# Altium schematic sheet ADAS_ECU_revA.SchDoc (part 1 of 2)
size E; SheetNumber: 1; SheetTotal: 19
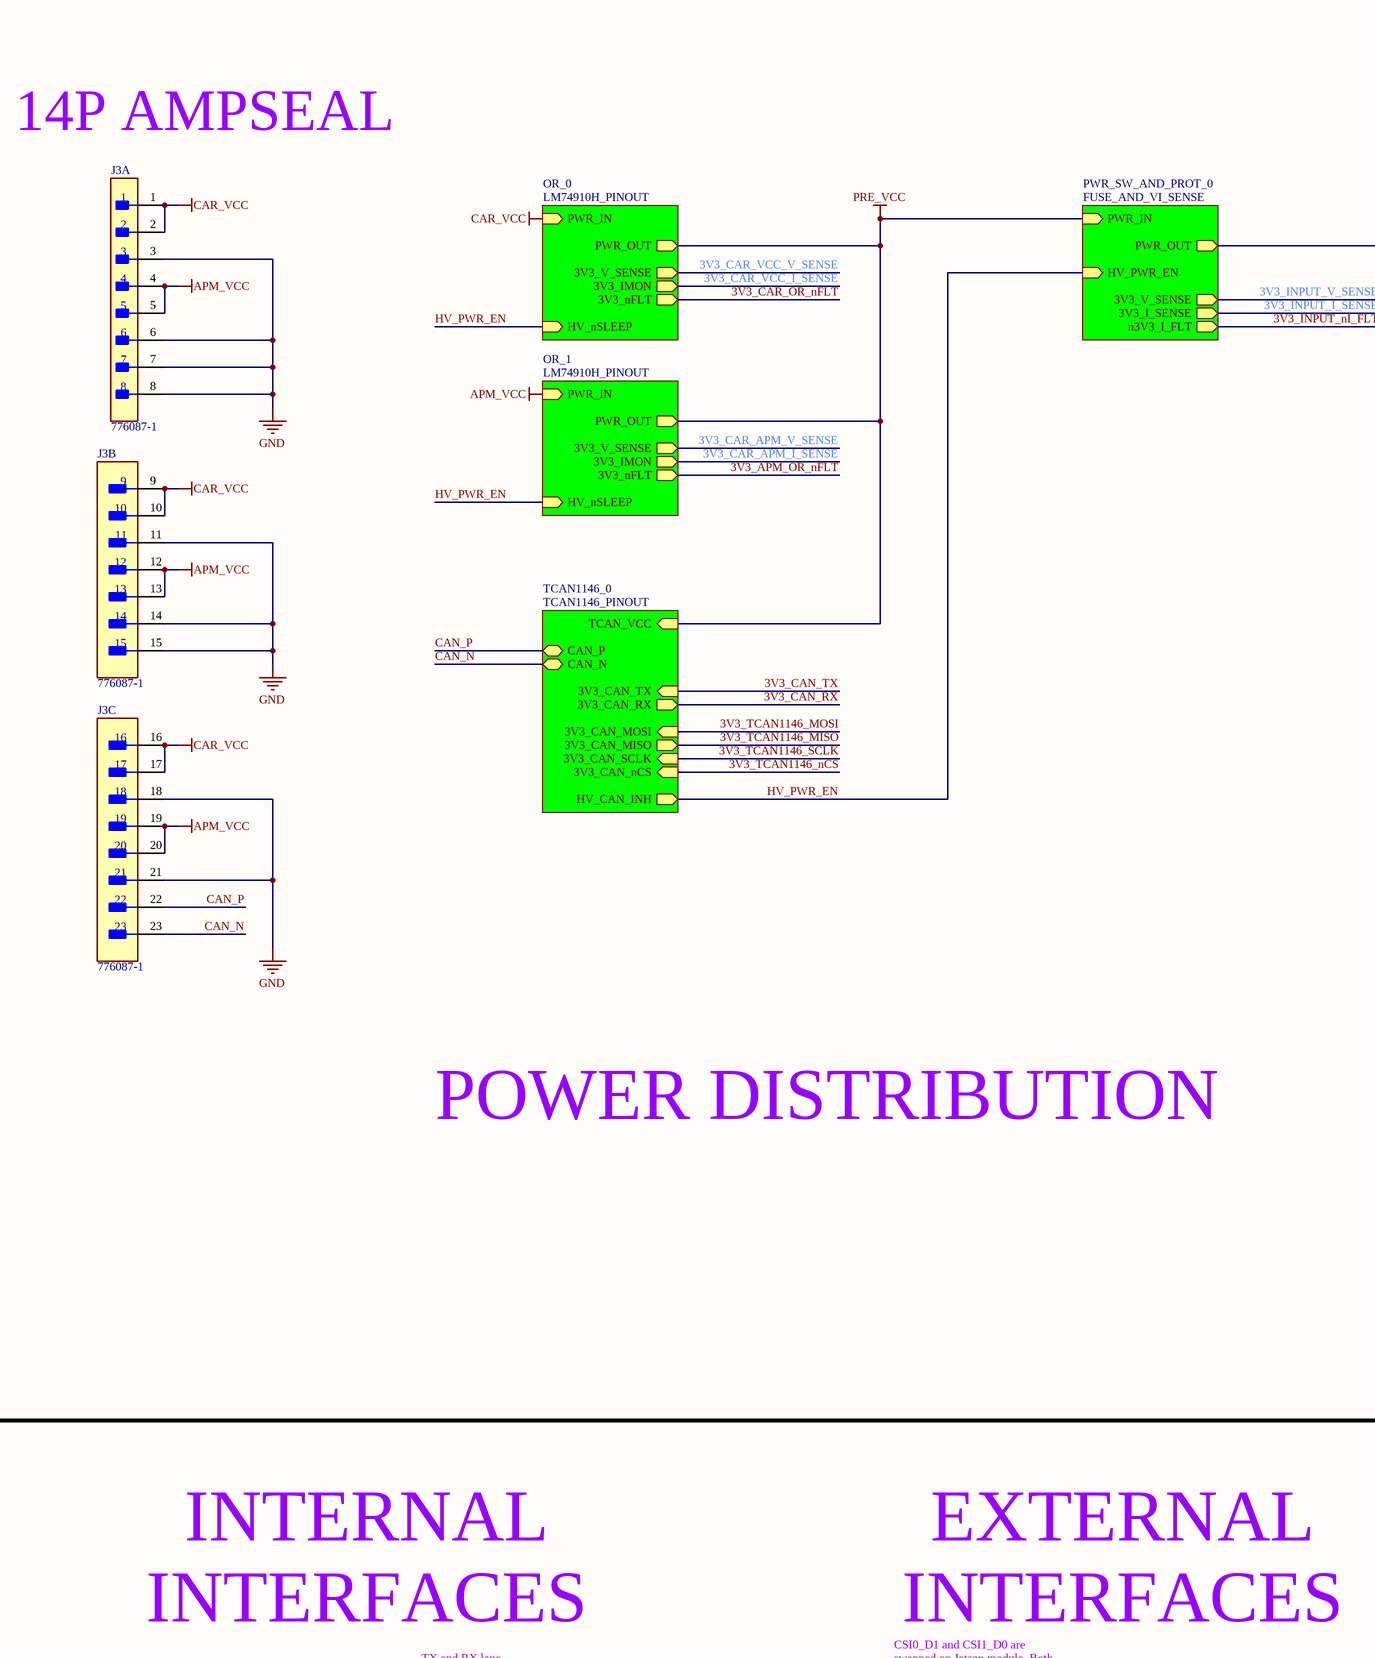
[diagram p0: ADAS_ECU_revA.SchDoc, top column 1 of 4]
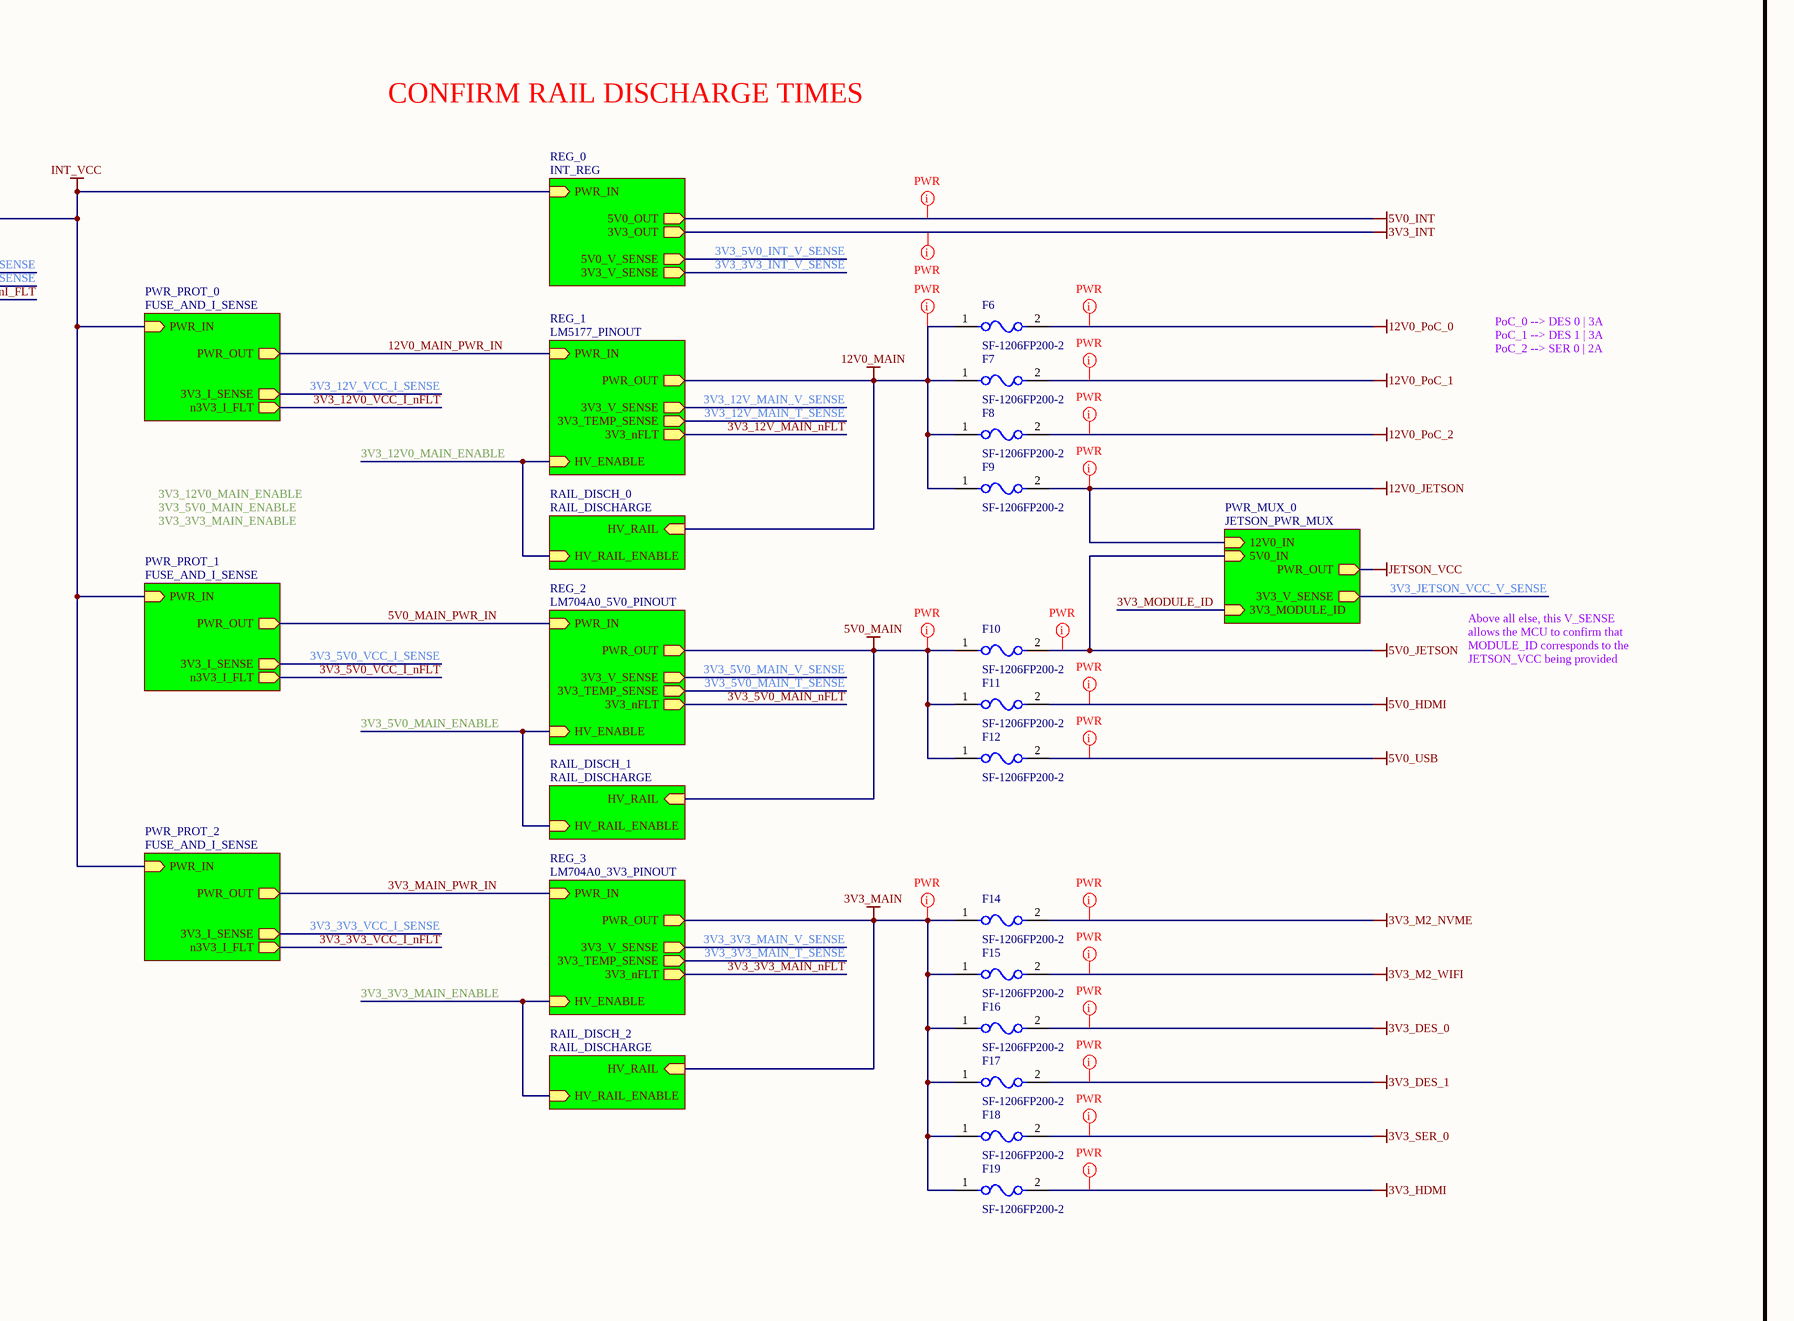
[diagram p1: ADAS_ECU_revA.SchDoc, top column 2 of 4]
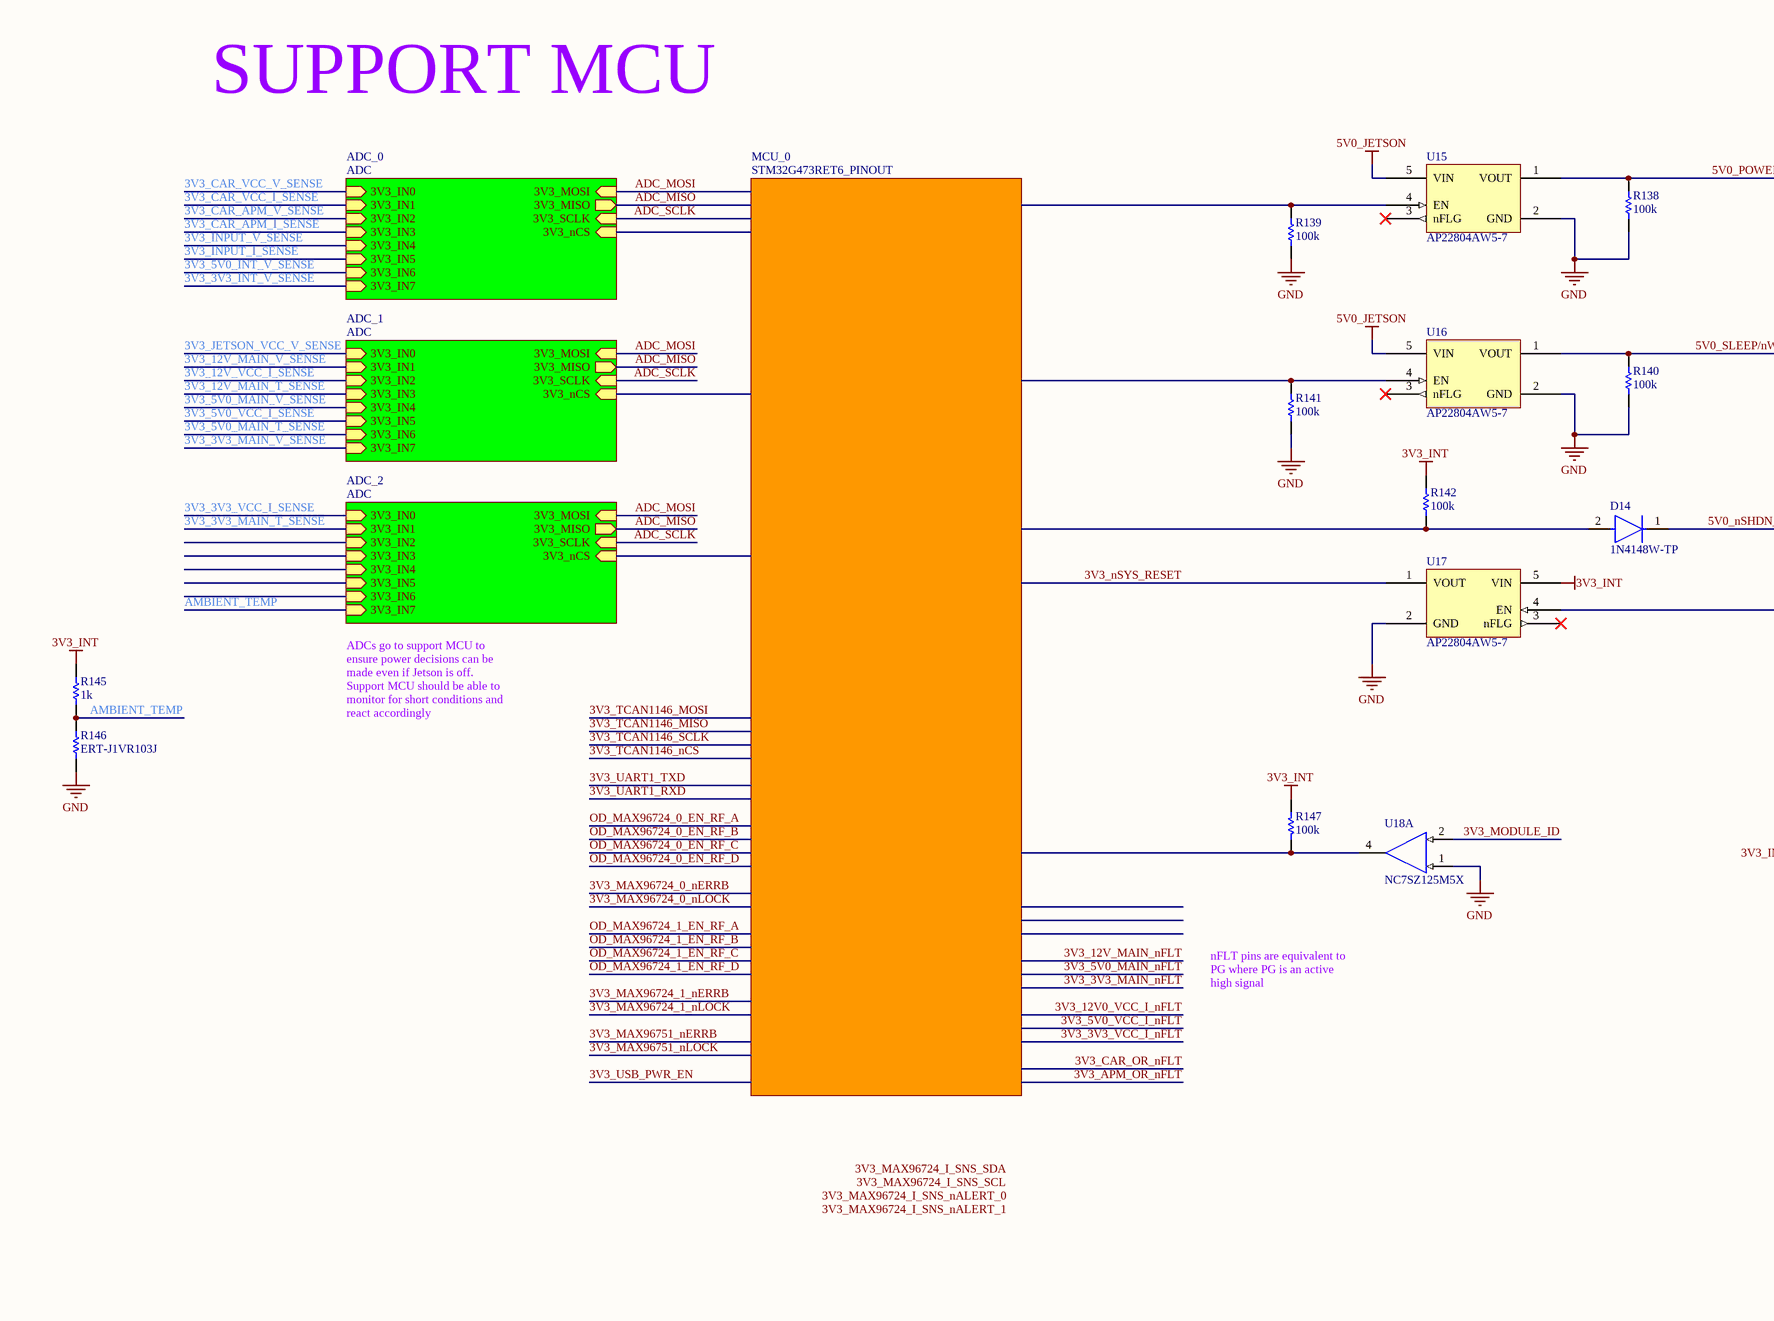
[diagram p2: ADAS_ECU_revA.SchDoc, top column 3 of 4]
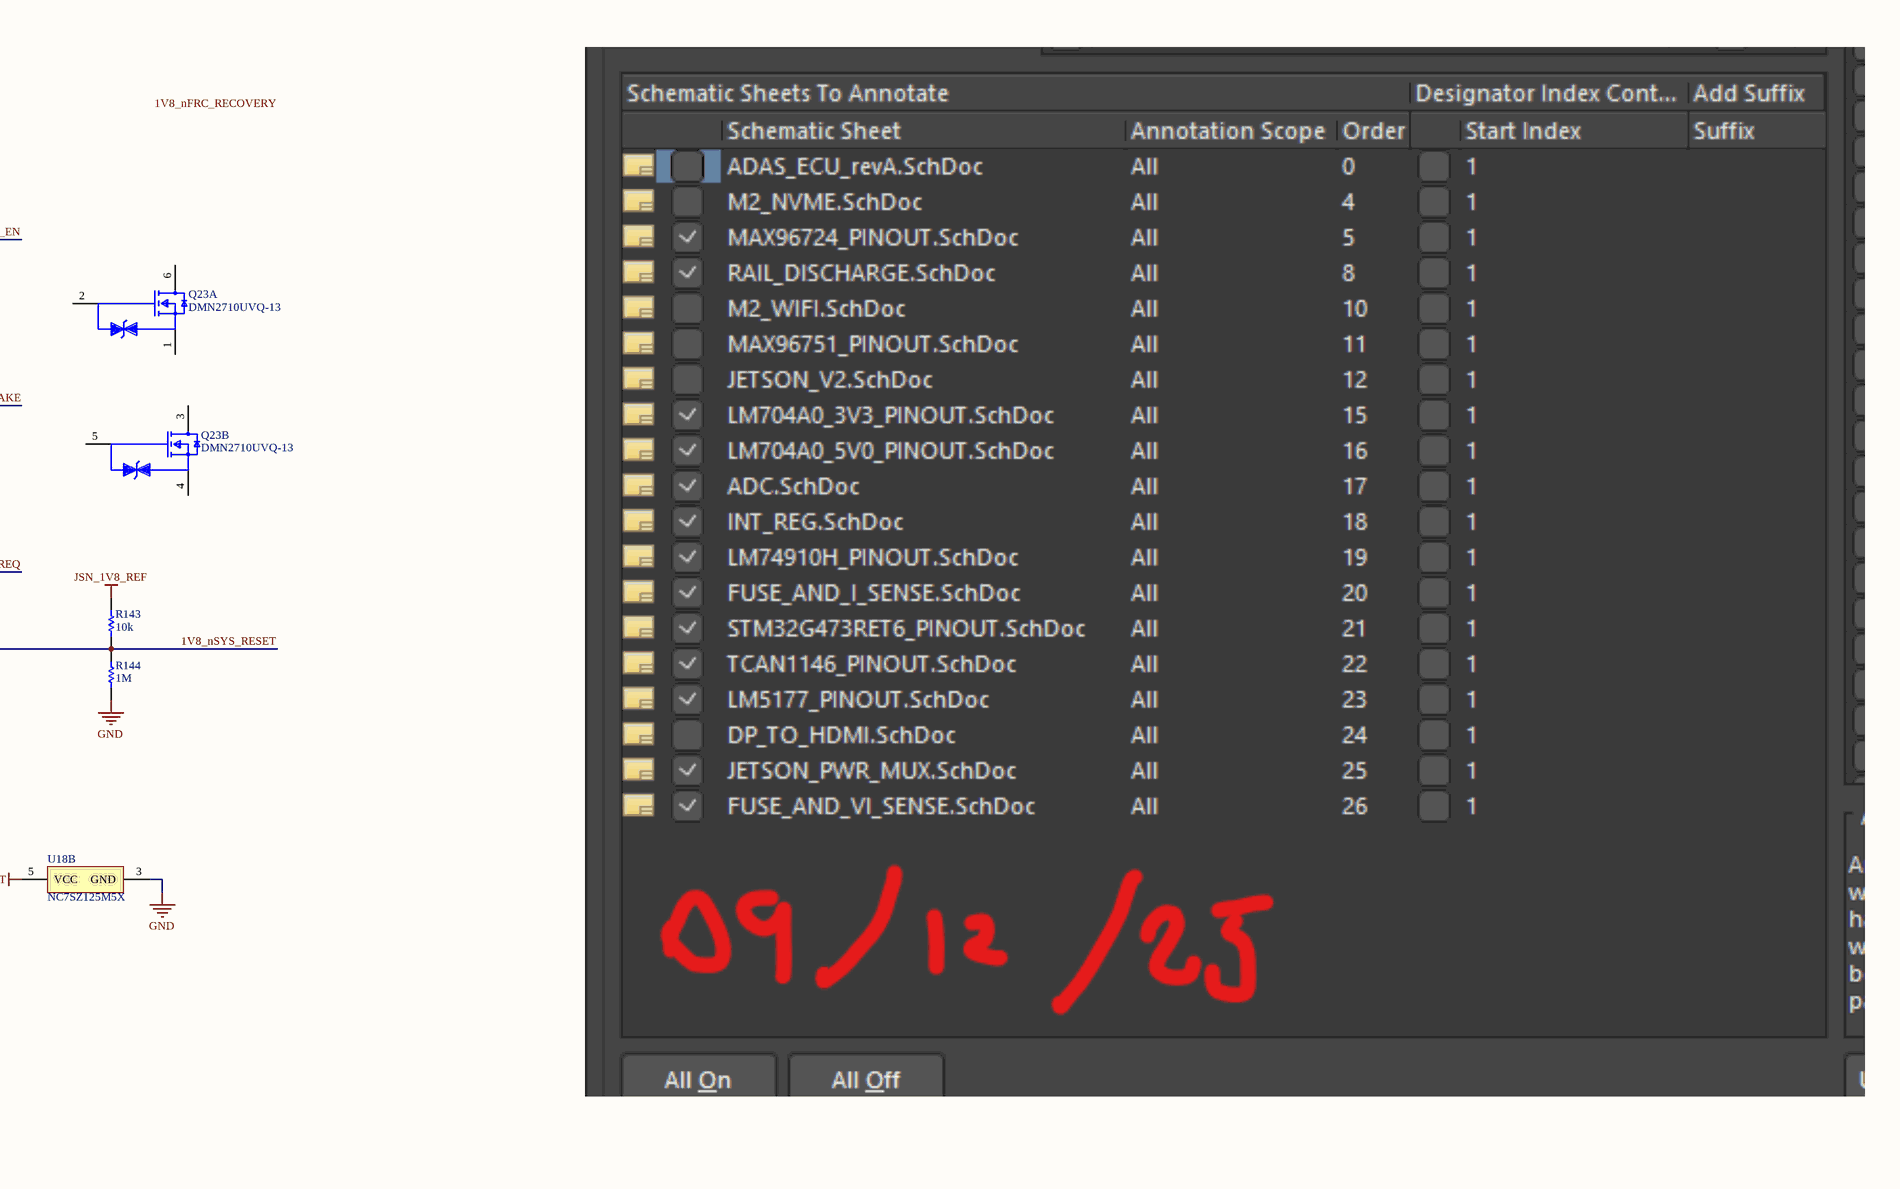
[diagram p3: ADAS_ECU_revA.SchDoc, top column 4 of 4]
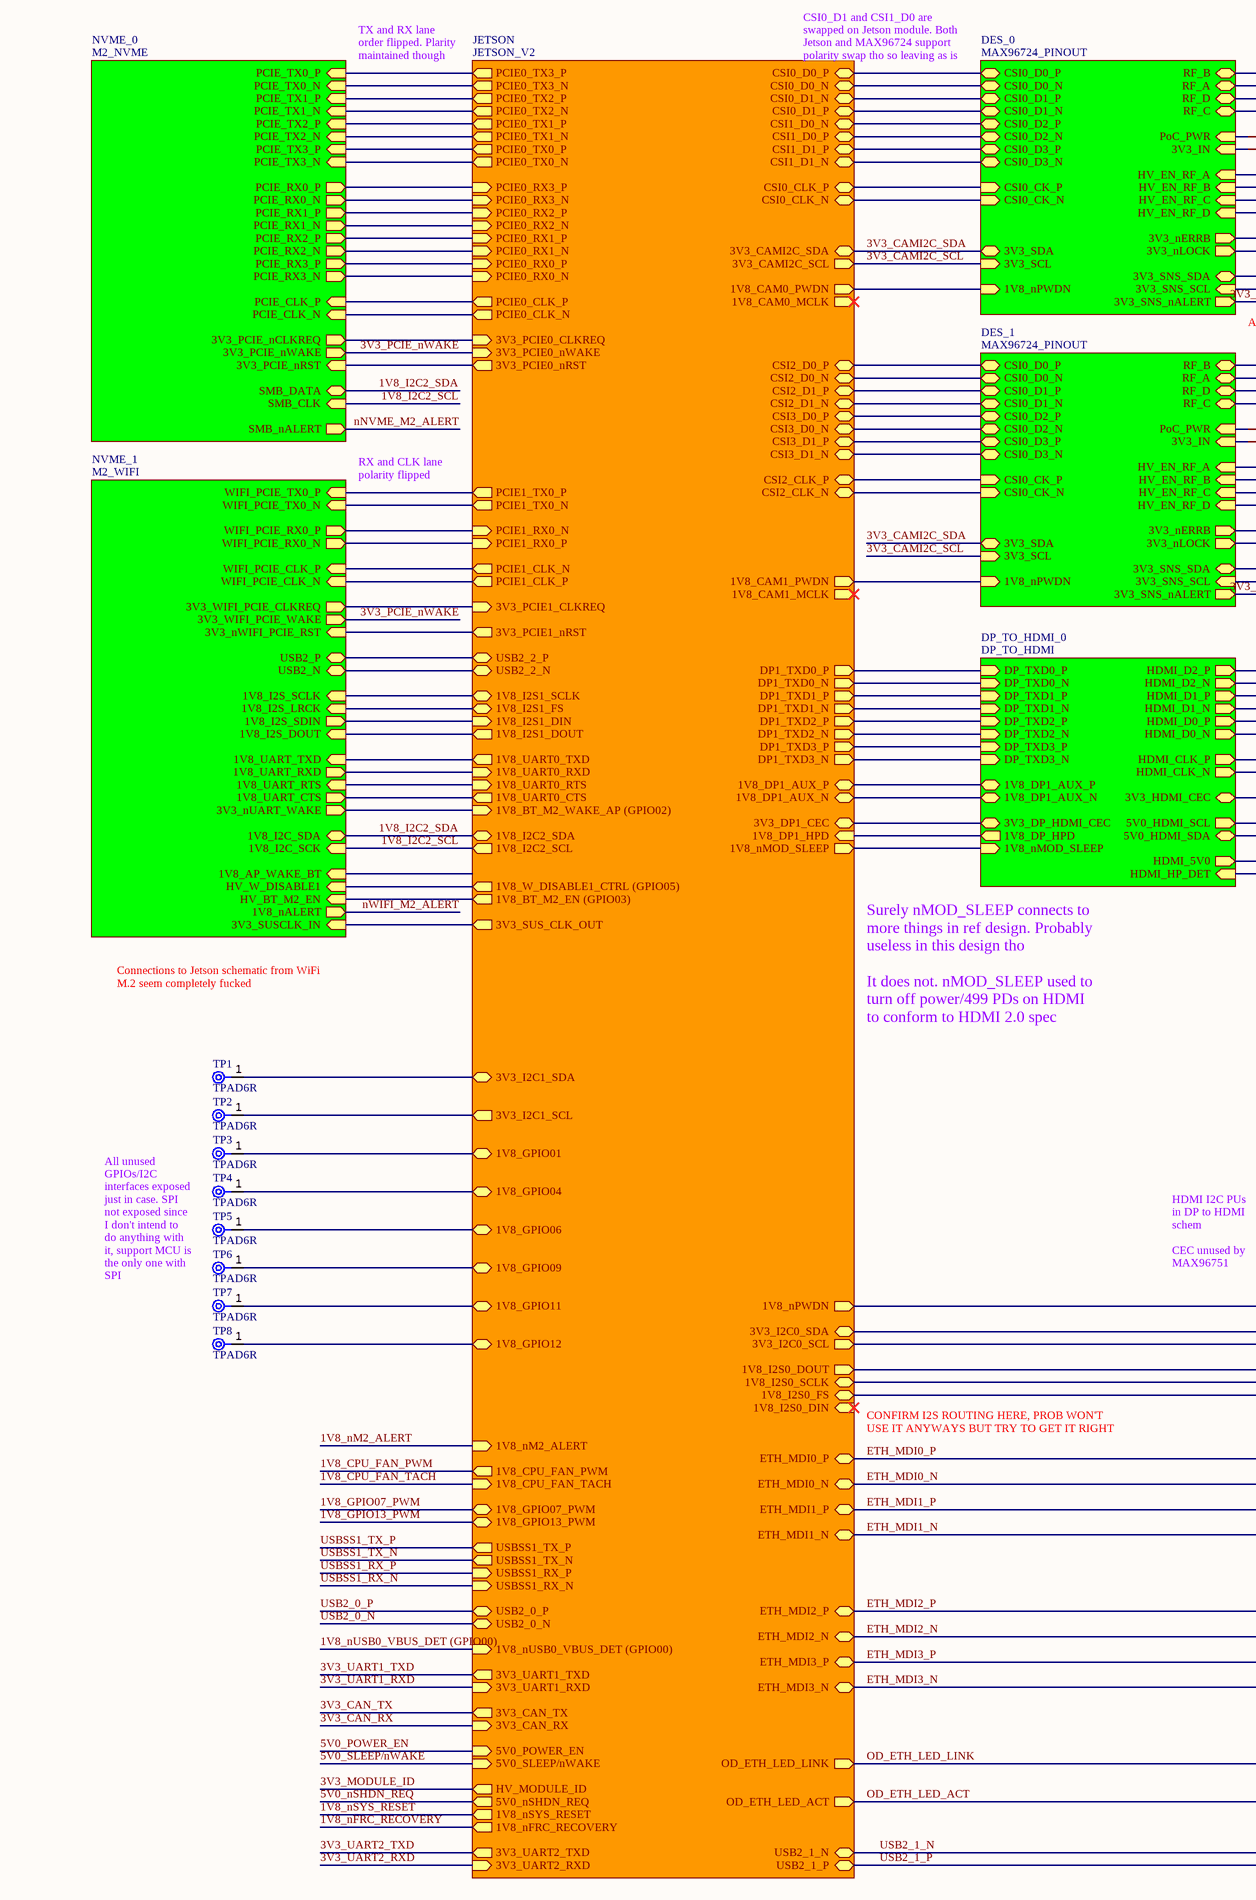
[diagram p4: ADAS_ECU_revA.SchDoc, centre column 1 of 4]
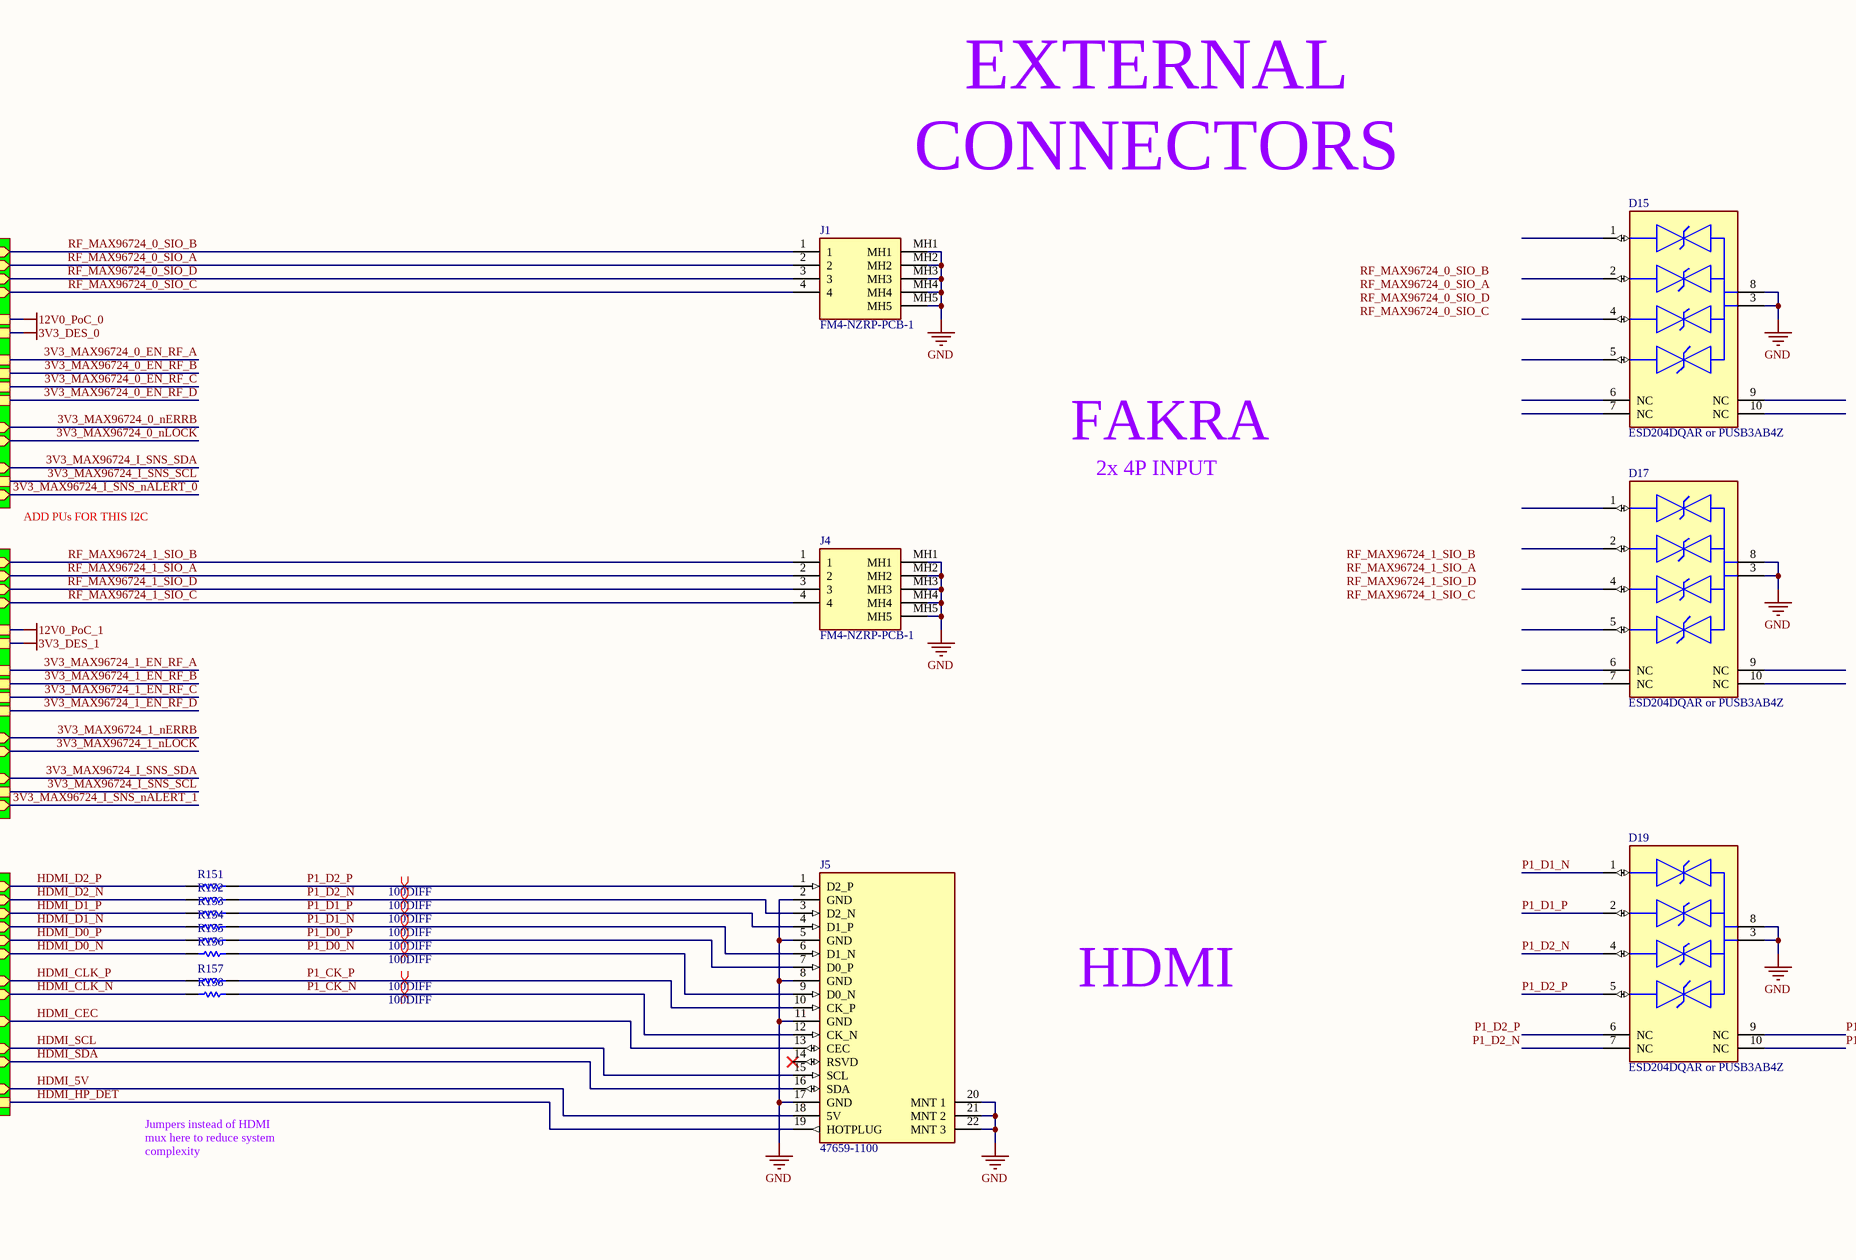
[diagram p5: ADAS_ECU_revA.SchDoc, centre column 2 of 4]
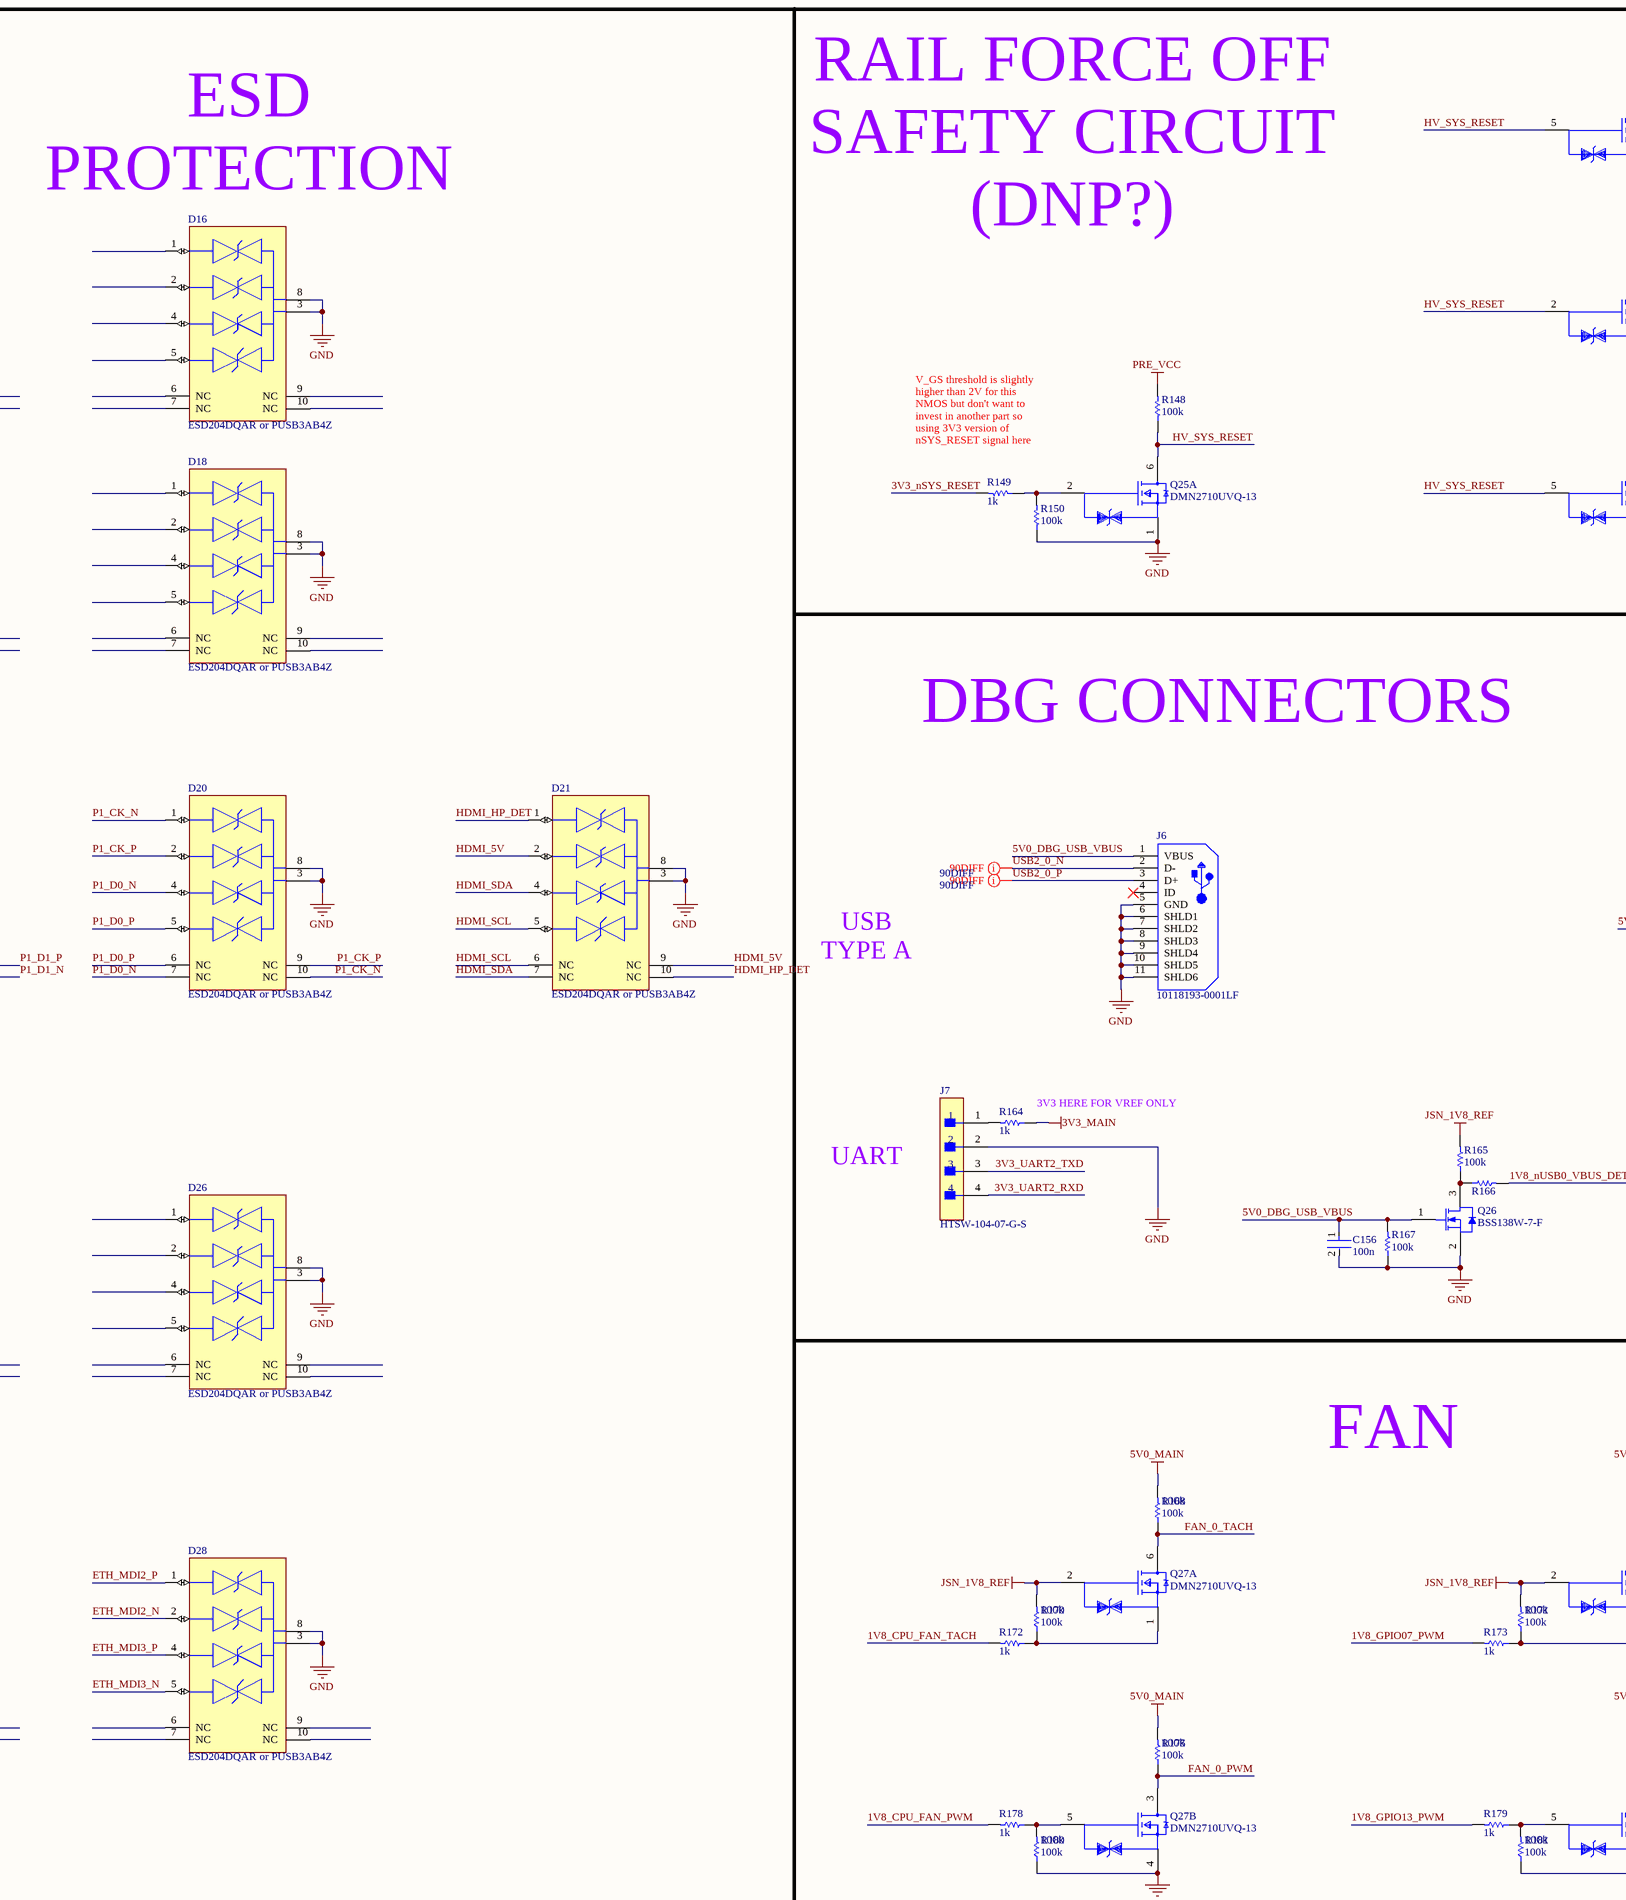
[diagram p6: ADAS_ECU_revA.SchDoc, centre column 3 of 4]
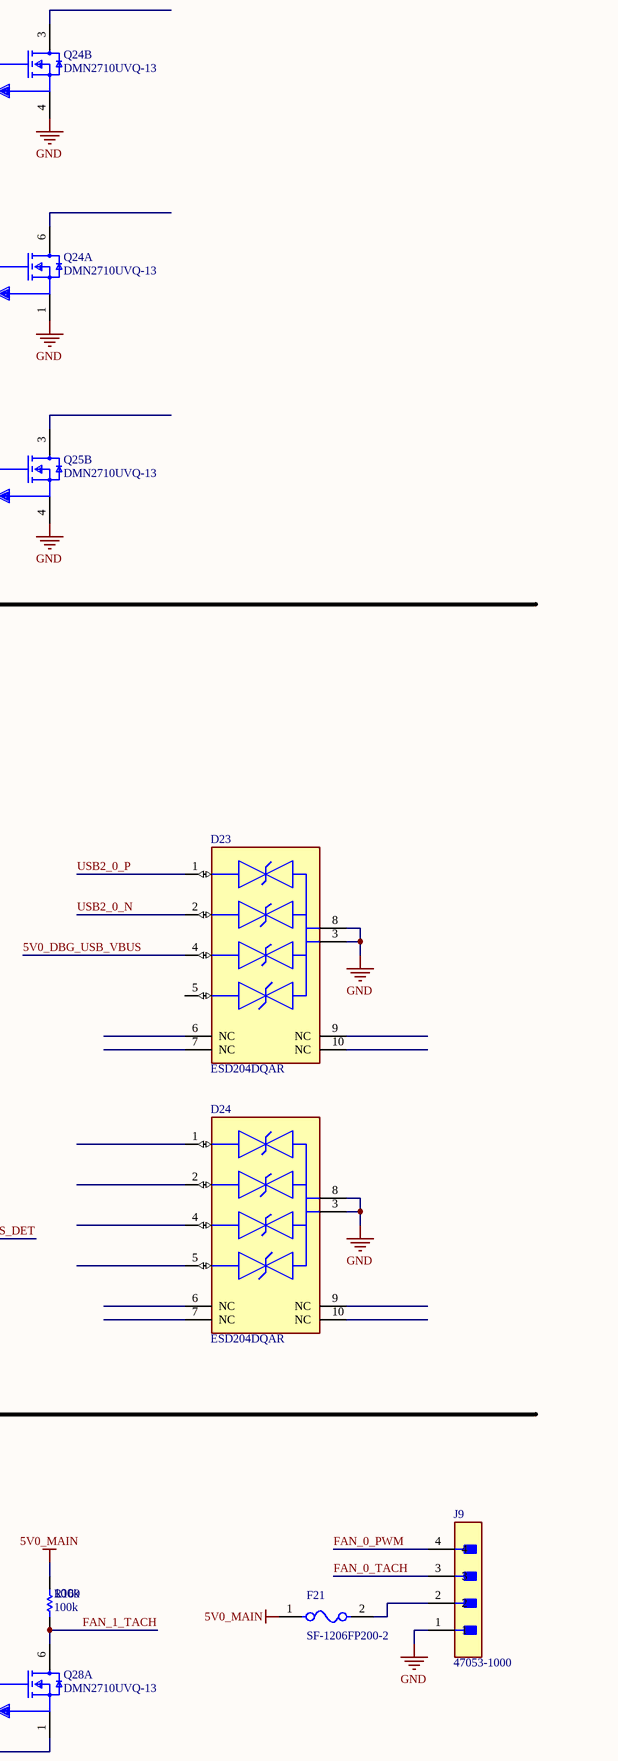
[diagram p7: ADAS_ECU_revA.SchDoc, centre column 4 of 4]
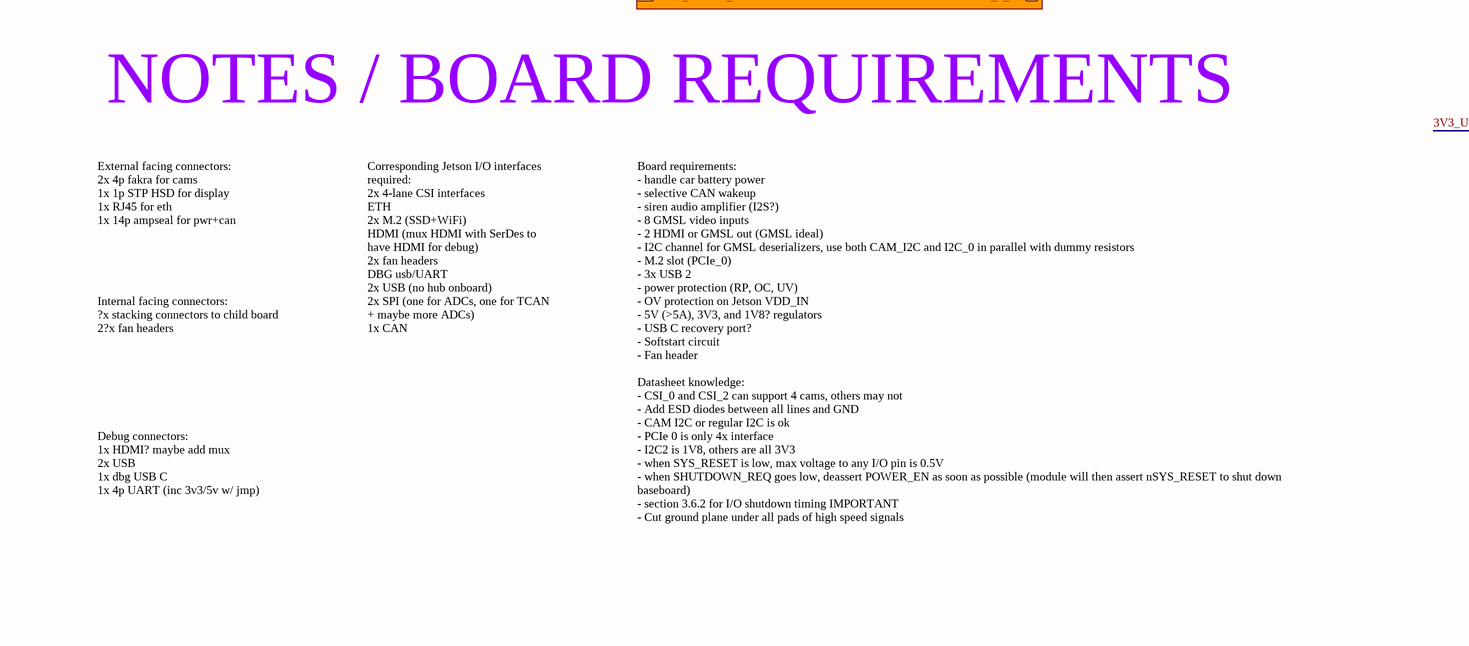
[diagram p8: ADAS_ECU_revA.SchDoc, bottom column 1 of 4]
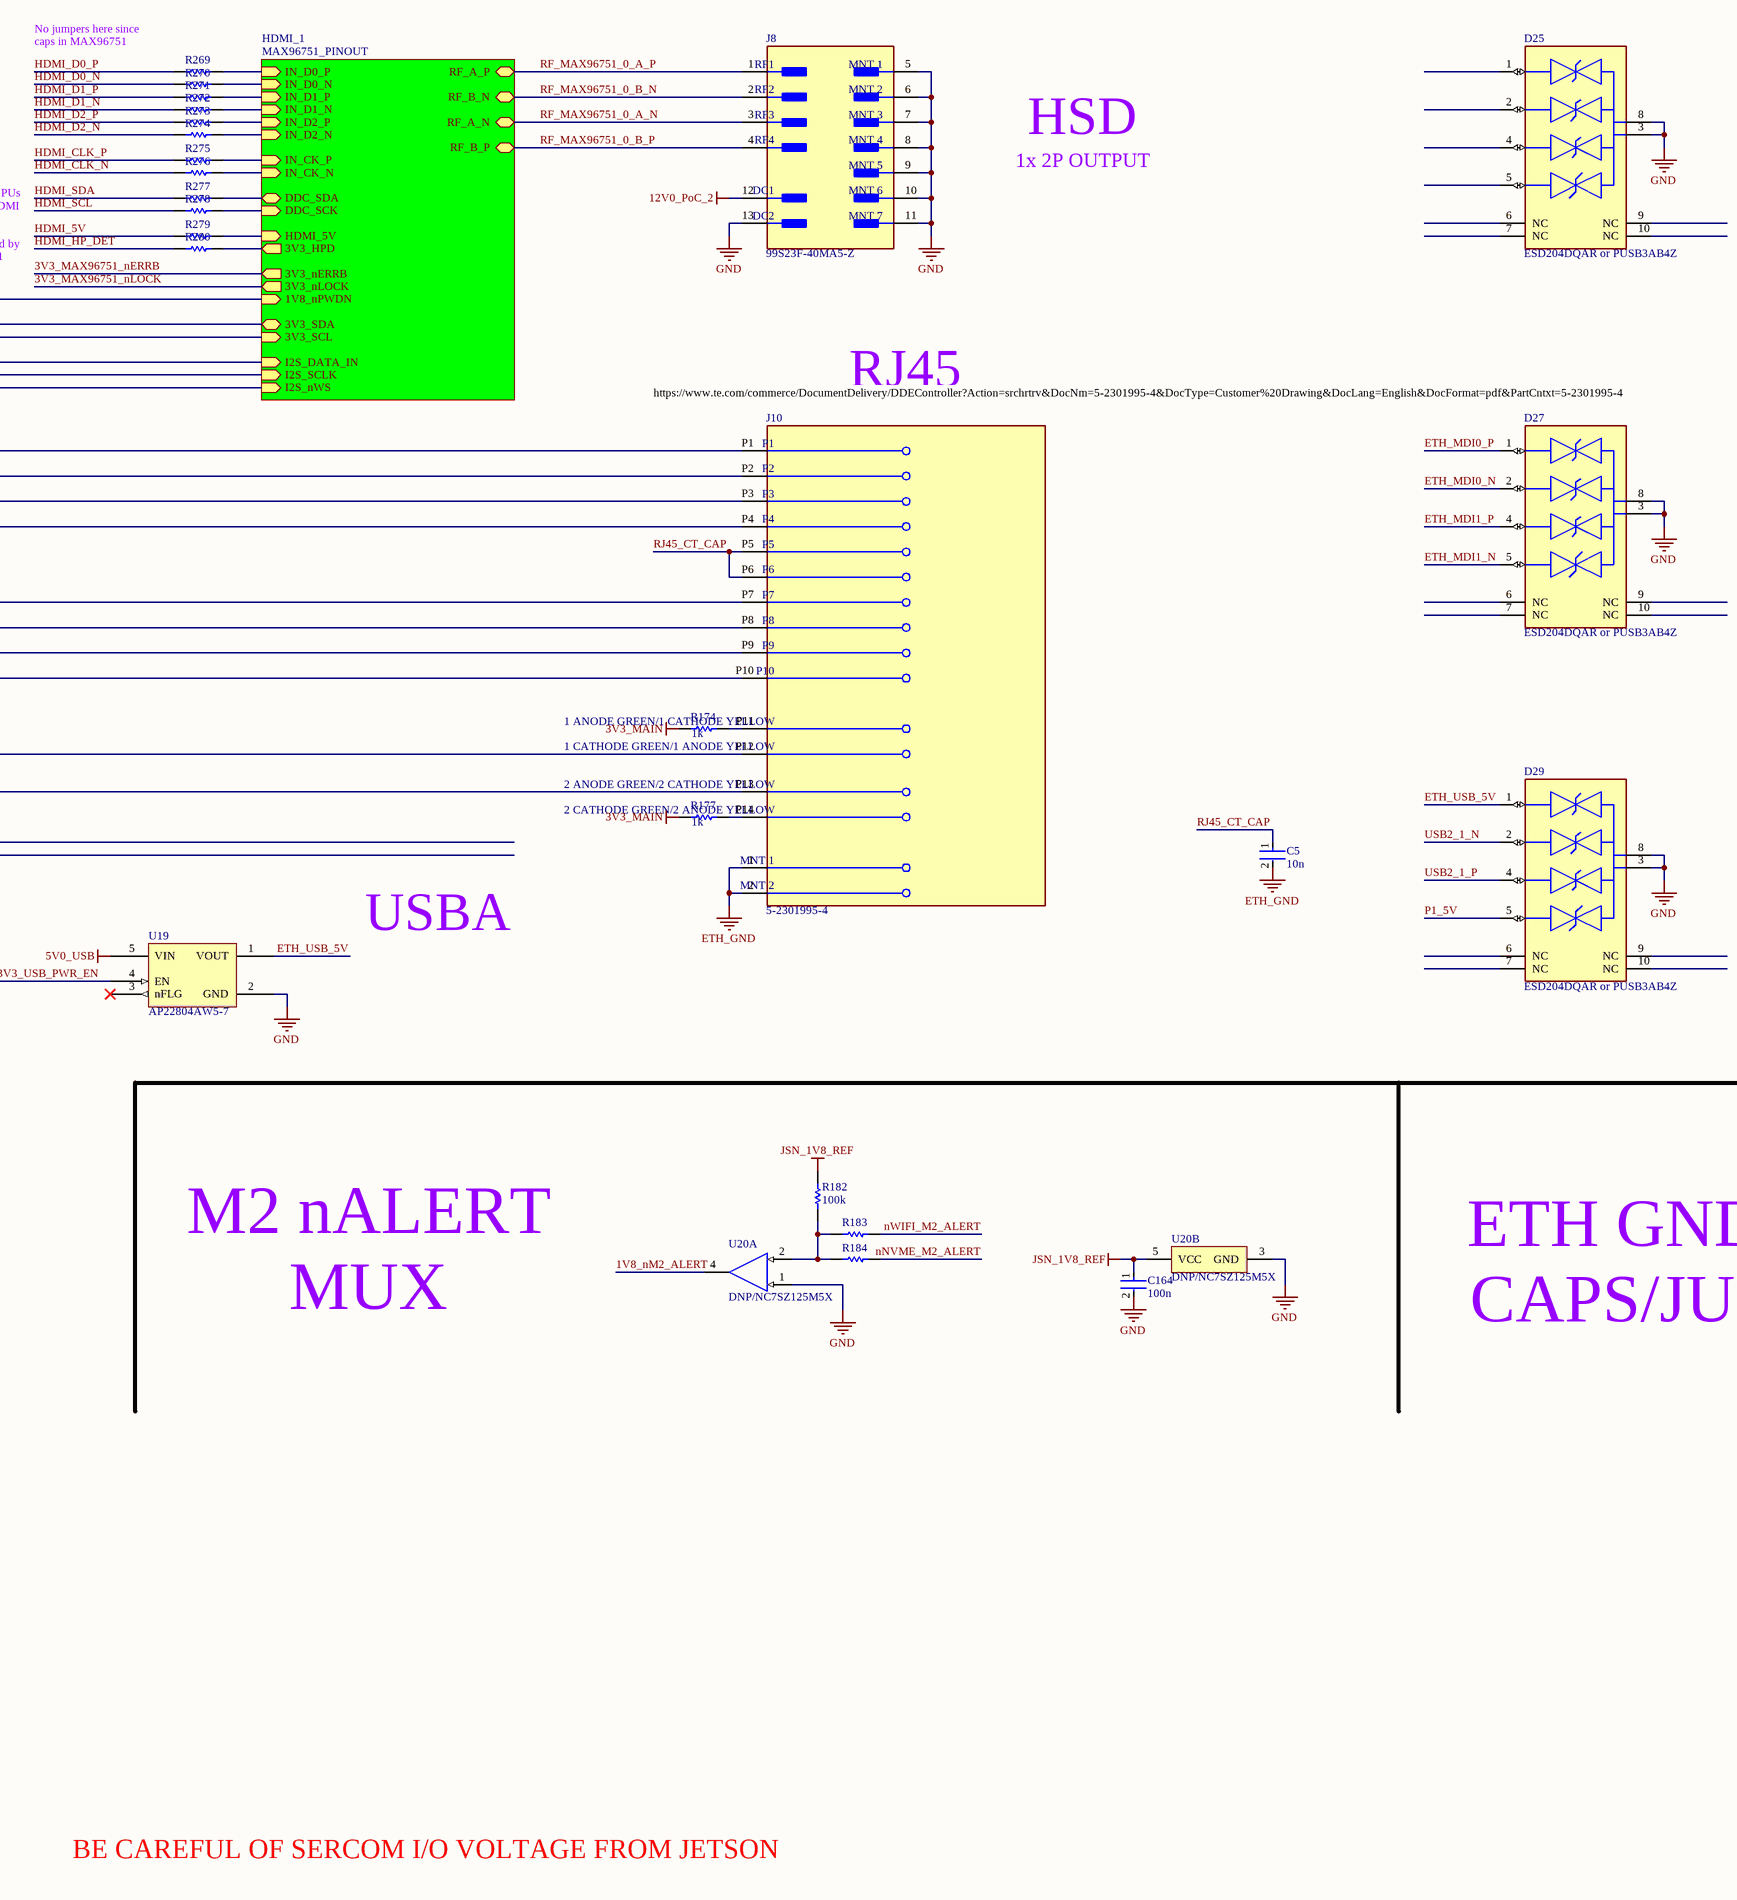
[diagram p9: ADAS_ECU_revA.SchDoc, bottom column 2 of 4]
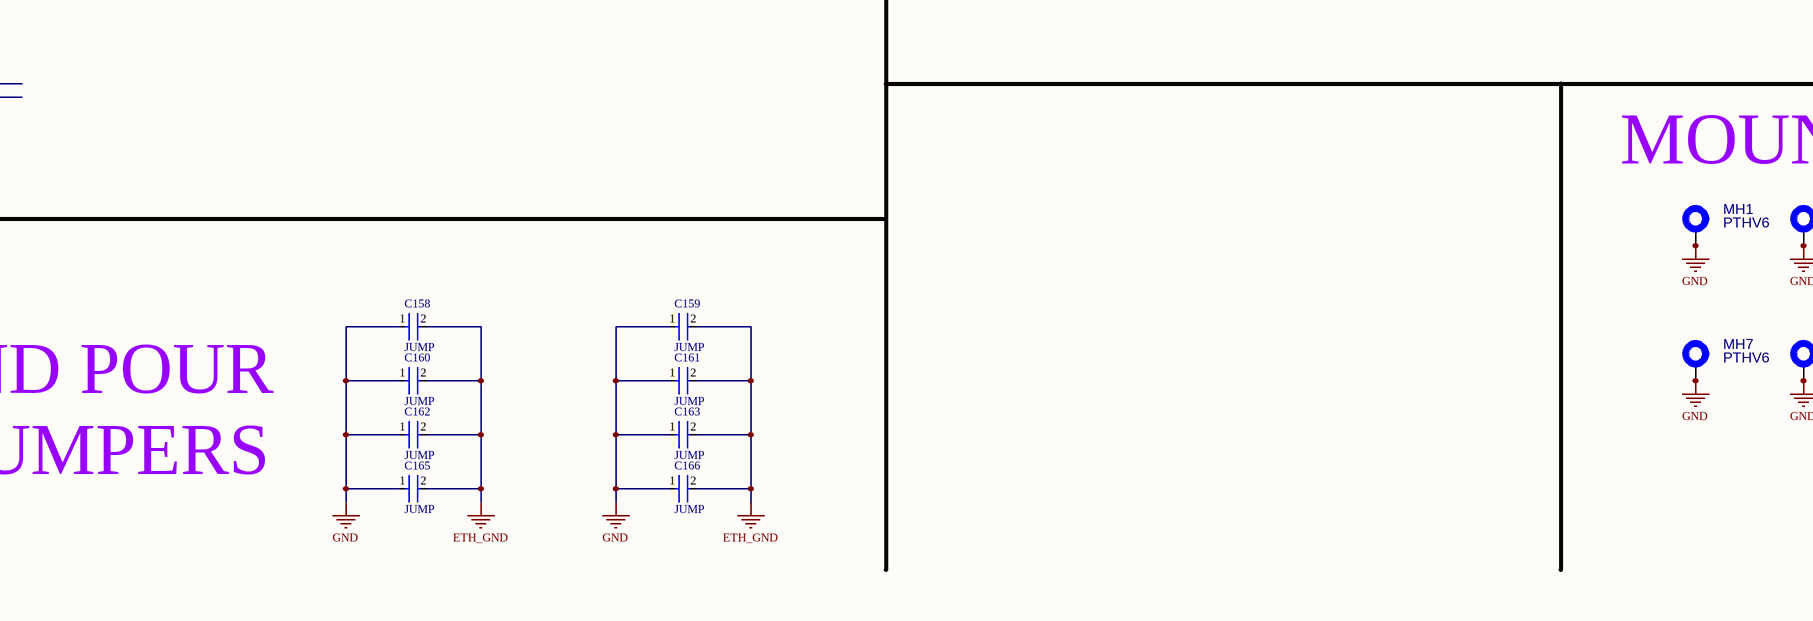
[diagram p10: ADAS_ECU_revA.SchDoc, bottom column 3 of 4]
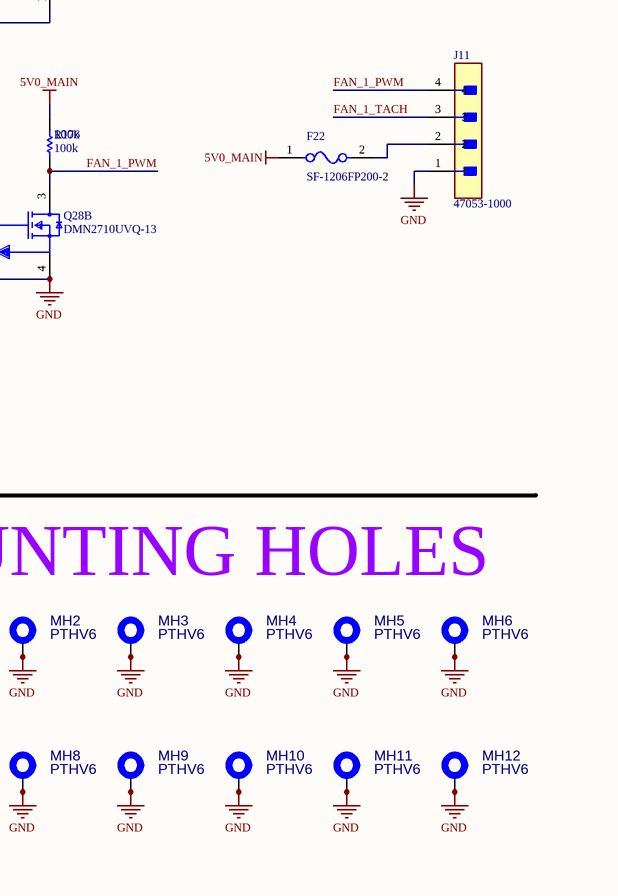
[diagram p11: ADAS_ECU_revA.SchDoc, bottom column 4 of 4]

## Parts
C5  10n  [FP-0402-L_1_0_0_05-W_0_5-IPC_A]
C156  100n  [FP-0402-L_1_0_0_05-W_0_5-IPC_A]
C158  JUMP  [FP-0402-L_1_0_0_05-W_0_5-IPC_A]
C159  JUMP  [FP-0402-L_1_0_0_05-W_0_5-IPC_A]
C160  JUMP  [FP-0402-L_1_0_0_05-W_0_5-IPC_A]
C161  JUMP  [FP-0402-L_1_0_0_05-W_0_5-IPC_A]
C162  JUMP  [FP-0402-L_1_0_0_05-W_0_5-IPC_A]
C163  JUMP  [FP-0402-L_1_0_0_05-W_0_5-IPC_A]
C164  100n  [FP-0402-L_1_0_0_05-W_0_5-IPC_A]
C165  JUMP  [FP-0402-L_1_0_0_05-W_0_5-IPC_A]
C166  JUMP  [FP-0402-L_1_0_0_05-W_0_5-IPC_A]
D14  1N4148W-TP  [FP-SOD-123-IPC_A]
D15  ESD204DQAR or PUSB3AB4Z  [FP-DQA0010A-MFG]
D16  ESD204DQAR or PUSB3AB4Z  [FP-DQA0010A-MFG]
D17  ESD204DQAR or PUSB3AB4Z  [FP-DQA0010A-MFG]
D18  ESD204DQAR or PUSB3AB4Z  [FP-DQA0010A-MFG]
D19  ESD204DQAR or PUSB3AB4Z  [FP-DQA0010A-MFG]
D20  ESD204DQAR or PUSB3AB4Z  [FP-DQA0010A-MFG]
D21  ESD204DQAR or PUSB3AB4Z  [FP-DQA0010A-MFG]
D23  ESD204DQAR  [FP-DQA0010A-MFG]
D24  ESD204DQAR  [FP-DQA0010A-MFG]
D25  ESD204DQAR or PUSB3AB4Z  [FP-DQA0010A-MFG]
D26  ESD204DQAR or PUSB3AB4Z  [FP-DQA0010A-MFG]
D27  ESD204DQAR or PUSB3AB4Z  [FP-DQA0010A-MFG]
D28  ESD204DQAR or PUSB3AB4Z  [FP-DQA0010A-MFG]
D29  ESD204DQAR or PUSB3AB4Z  [FP-DQA0010A-MFG]
F6  SF-1206FP200-2  [FP-SF-1206FP-MFG]
F7  SF-1206FP200-2  [FP-SF-1206FP-MFG]
F8  SF-1206FP200-2  [FP-SF-1206FP-MFG]
F9  SF-1206FP200-2  [FP-SF-1206FP-MFG]
F10  SF-1206FP200-2  [FP-SF-1206FP-MFG]
F11  SF-1206FP200-2  [FP-SF-1206FP-MFG]
F12  SF-1206FP200-2  [FP-SF-1206FP-MFG]
F14  SF-1206FP200-2  [FP-SF-1206FP-MFG]
F15  SF-1206FP200-2  [FP-SF-1206FP-MFG]
F16  SF-1206FP200-2  [FP-SF-1206FP-MFG]
F17  SF-1206FP200-2  [FP-SF-1206FP-MFG]
F18  SF-1206FP200-2  [FP-SF-1206FP-MFG]
F19  SF-1206FP200-2  [FP-SF-1206FP-MFG]
F21  SF-1206FP200-2  [FP-SF-1206FP-MFG]
F22  SF-1206FP200-2  [FP-SF-1206FP-MFG]
J1  FM4-NZRP-PCB-1  [FM4-NZRP-PCB-1-Footprint-1]
J3  776087-1  [FP-776087-1-MFG]  (parts A,B,C of 3)
J4  FM4-NZRP-PCB-1  [FM4-NZRP-PCB-1-Footprint-1]
J5  47659-1100  [FP-47659-1100-MFG]
J6  10118193-0001LF  [FCI-10118193-0001LF-5_V]
J7  HTSW-104-07-G-S  [FP-HTSW-104-07-G-S-MFG]
J8  99S23F-40MA5-Z  [FP-99S23F-40MA5-Z-MFG]
J9  47053-1000  [FP-470531000-MFG]
J10  5-2301995-4  [FP-5-2301995-4-MFG]
J11  47053-1000  [FP-470531000-MFG]
MH1  PTHV6  [PTHV6 M2]  (net tie, no BOM)
MH2  PTHV6  [PTHV6 M2]  (net tie, no BOM)
MH3  PTHV6  [PTHV6 M2]  (net tie, no BOM)
MH4  PTHV6  [PTHV6 M2]  (net tie, no BOM)
MH5  PTHV6  [PTHV6 M2]  (net tie, no BOM)
MH6  PTHV6  [PTHV6 M2]  (net tie, no BOM)
MH7  PTHV6  [PTHV6 M2]  (net tie, no BOM)
MH8  PTHV6  [PTHV6 M2]  (net tie, no BOM)
MH9  PTHV6  [PTHV6 M2]  (net tie, no BOM)
MH10  PTHV6  [PTHV6 M2]  (net tie, no BOM)
MH11  PTHV6  [PTHV6 M2]  (net tie, no BOM)
MH12  PTHV6  [PTHV6 M2]  (net tie, no BOM)
Q23  DMN2710UVQ-13  [SOTFL50P162X60-6N]  (parts A,B of 2)
Q24  DMN2710UVQ-13  [SOTFL50P162X60-6N]  (parts A,B of 2)
Q25  DMN2710UVQ-13  [SOTFL50P162X60-6N]  (parts A,B of 2)
Q26  BSS138W-7-F  [DIOD-SOT323-3_V]
Q27  DMN2710UVQ-13  [SOTFL50P162X60-6N]  (parts A,B of 2)
Q28  DMN2710UVQ-13  [SOTFL50P162X60-6N]  (parts A,B of 2)
R138  100k  [R0603B]
R139  100k  [R0603B]
R140  100k  [R0603B]
R141  100k  [R0603B]
R142  100k  [R0603B]
R143  10k  [R0603B]
R144  1M  [R0603B]
R145  1k  [R0603B]
R146  ERT-J1VR103J  [RESC1608X90X30ML15T20]
R147  100k  [R0603B]
R148  100k  [R0603B]
R149  1k  [R0603B]
R150  100k  [R0603B]
R151  0402 JUMPER  [RESC1005X40X25ML05T05]  (value not drawn)
R152  0402 JUMPER  [RESC1005X40X25ML05T05]  (value not drawn)
R153  0402 JUMPER  [RESC1005X40X25ML05T05]  (value not drawn)
R154  0402 JUMPER  [RESC1005X40X25ML05T05]  (value not drawn)
R155  0402 JUMPER  [RESC1005X40X25ML05T05]  (value not drawn)
R156  0402 JUMPER  [RESC1005X40X25ML05T05]  (value not drawn)
R157  0402 JUMPER  [RESC1005X40X25ML05T05]  (value not drawn)
R158  0402 JUMPER  [RESC1005X40X25ML05T05]  (value not drawn)
R164  1k  [R0603B]
R165  100k  [R0603B]
R166  0402 JUMPER  [RESC1005X40X25ML05T05]  (value not drawn)
R167  100k  [R0603B]
R168  100k  [R0603B]
R169  100k  [R0603B]
R170  100k  [R0603B]
R171  100k  [R0603B]
R172  1k  [R0603B]
R173  1k  [R0603B]
R174  1k  [R0603B]
R175  100k  [R0603B]
R176  100k  [R0603B]
R177  1k  [R0603B]
R178  1k  [R0603B]
R179  1k  [R0603B]
R180  100k  [R0603B]
R181  100k  [R0603B]
R182  100k  [R0603B]
R183  0402 JUMPER  [RESC1005X40X25ML05T05]  (value not drawn)
R184  0402 JUMPER  [RESC1005X40X25ML05T05]  (value not drawn)
R269  0402 JUMPER  [RESC1005X40X25ML05T05]  (value not drawn)
R270  0402 JUMPER  [RESC1005X40X25ML05T05]  (value not drawn)
R271  0402 JUMPER  [RESC1005X40X25ML05T05]  (value not drawn)
R272  0402 JUMPER  [RESC1005X40X25ML05T05]  (value not drawn)
R273  0402 JUMPER  [RESC1005X40X25ML05T05]  (value not drawn)
R274  0402 JUMPER  [RESC1005X40X25ML05T05]  (value not drawn)
R275  0402 JUMPER  [RESC1005X40X25ML05T05]  (value not drawn)
R276  0402 JUMPER  [RESC1005X40X25ML05T05]  (value not drawn)
R277  0402 JUMPER  [RESC1005X40X25ML05T05]  (value not drawn)
R278  0402 JUMPER  [RESC1005X40X25ML05T05]  (value not drawn)
R279  0402 JUMPER  [RESC1005X40X25ML05T05]  (value not drawn)
R280  0402 JUMPER  [RESC1005X40X25ML05T05]  (value not drawn)
TP1  TPAD6R  [New footprint 1]  (no BOM)
TP2  TPAD6R  [New footprint 1]  (no BOM)
TP3  TPAD6R  [New footprint 1]  (no BOM)
TP4  TPAD6R  [New footprint 1]  (no BOM)
TP5  TPAD6R  [New footprint 1]  (no BOM)
TP6  TPAD6R  [New footprint 1]  (no BOM)
TP7  TPAD6R  [New footprint 1]  (no BOM)
TP8  TPAD6R  [New footprint 1]  (no BOM)
U15  AP22804AW5-7  [SOT95P285X140-5N]
U16  AP22804AW5-7  [SOT95P285X140-5N]
U17  AP22804AW5-7  [SOT95P285X140-5N]
U18  NC7SZ125M5X  [FAIR-SOT23-5_V]  (parts A,B of 2)
U19  AP22804AW5-7  [SOT95P285X140-5N]
U20  DNP/NC7SZ125M5X  [FAIR-SOT23-5_V]  (parts A,B of 2)

## Sub-sheets
ADC_0 = ADC: 3V3_IN0 (in), 3V3_MOSI (in), 3V3_MISO (out), 3V3_SCLK (in), 3V3_nCS (in), 3V3_IN1 (in), 3V3_IN2 (in), 3V3_IN3 (in), 3V3_IN4 (in), 3V3_IN5 (in), 3V3_IN6 (in), 3V3_IN7 (in)
ADC_1 = ADC: 3V3_MOSI (in), 3V3_MISO (out), 3V3_SCLK (in), 3V3_nCS (in), 3V3_IN0 (in), 3V3_IN1 (in), 3V3_IN2 (in), 3V3_IN3 (in), 3V3_IN4 (in), 3V3_IN5 (in), 3V3_IN6 (in), 3V3_IN7 (in)
ADC_2 = ADC: 3V3_MOSI (in), 3V3_MISO (out), 3V3_SCLK (in), 3V3_nCS (in), 3V3_IN0 (in), 3V3_IN1 (in), 3V3_IN2 (in), 3V3_IN3 (in), 3V3_IN4 (in), 3V3_IN5 (in), 3V3_IN6 (in), 3V3_IN7 (in)
DES_0 = MAX96724_PINOUT: CSI0_D0_P (bidir), CSI0_D0_N (bidir), CSI0_D1_P (bidir), CSI0_D1_N (bidir), CSI0_D2_P (bidir), CSI0_D2_N (bidir), CSI0_D3_P (bidir), CSI0_D3_N (bidir), CSI0_CK_P (in), CSI0_CK_N (in), PoC_PWR (in), RF_B (bidir), RF_A (bidir), RF_C (bidir), RF_D (bidir), 3V3_IN (in), 3V3_SDA (bidir), 3V3_SCL (in), 1V8_nPWDN (in), 3V3_SNS_SDA (bidir), 3V3_SNS_SCL (in), 3V3_nERRB (out), 3V3_nLOCK (out), 3V3_SNS_nALERT (out), HV_EN_RF_A (in), HV_EN_RF_B (in), HV_EN_RF_C (in), HV_EN_RF_D (in)
DES_1 = MAX96724_PINOUT: CSI0_D0_P (bidir), CSI0_D0_N (bidir), CSI0_D1_P (bidir), CSI0_D1_N (bidir), CSI0_D2_P (bidir), CSI0_D2_N (bidir), CSI0_D3_P (bidir), CSI0_D3_N (bidir), CSI0_CK_P (in), CSI0_CK_N (in), PoC_PWR (in), RF_B (bidir), RF_A (bidir), RF_C (bidir), RF_D (bidir), 3V3_IN (in), 3V3_SDA (bidir), 3V3_SCL (in), 1V8_nPWDN (in), 3V3_SNS_SDA (bidir), 3V3_SNS_SCL (in), 3V3_nERRB (out), 3V3_nLOCK (out), HV_EN_RF_A (in), HV_EN_RF_B (in), HV_EN_RF_C (in), HV_EN_RF_D (in), 3V3_SNS_nALERT (out)
DP_TO_HDMI_0 = DP_TO_HDMI: 1V8_DP_HPD (out), HDMI_D2_P (out), HDMI_D2_N (out), HDMI_D1_P (out), HDMI_D1_N (out), HDMI_D0_P (out), HDMI_D0_N (out), HDMI_CLK_P (out), HDMI_CLK_N (out), HDMI_HP_DET (in), DP_TXD0_P (in), DP_TXD0_N (in), DP_TXD1_P (in), DP_TXD1_N (in), DP_TXD2_P (in), DP_TXD2_N (in), DP_TXD3_P (in), DP_TXD3_N (in), 1V8_DP1_AUX_N (bidir), 1V8_DP1_AUX_P (bidir), 3V3_HDMI_CEC (bidir), 1V8_nMOD_SLEEP (in), 3V3_DP_HDMI_CEC (bidir), 5V0_HDMI_SDA (bidir), 5V0_HDMI_SCL (out), HDMI_5V0 (out)
HDMI_1 = MAX96751_PINOUT: IN_D0_P (in), IN_D0_N (in), IN_D1_P (in), IN_D1_N (in), IN_D2_P (in), IN_D2_N (in), IN_CK_N (in), IN_CK_P (in), DDC_SCK (in), DDC_SDA (bidir), 3V3_HPD (out), RF_A_P (bidir), RF_A_N (bidir), RF_B_P (bidir), RF_B_N (bidir), HDMI_5V (in), 1V8_nPWDN (in), 3V3_nERRB (out), 3V3_nLOCK (out), 3V3_SCL (in), 3V3_SDA (bidir), I2S_nWS (in), I2S_SCLK (in), I2S_DATA_IN (in)
JETSON = JETSON_V2: CSI0_D0_N (bidir), CSI0_D0_P (bidir), CSI0_D1_N (bidir), CSI0_D1_P (bidir), CSI1_D0_N (bidir), CSI1_D0_P (bidir), CSI1_D1_N (bidir), CSI1_D1_P (bidir), CSI0_CLK_N (bidir), CSI0_CLK_P (bidir), PCIE0_TX0_N (out), PCIE0_TX0_P (out), PCIE0_TX1_N (out), PCIE0_TX1_P (out), PCIE0_TX2_N (out), PCIE0_TX2_P (out), PCIE0_TX3_N (out), PCIE0_TX3_P (out), PCIE0_CLK_N (out), PCIE0_CLK_P (out), 3V3_PCIE0_CLKREQ (in), 3V3_PCIE0_nWAKE (in), 3V3_PCIE0_nRST (out), PCIE1_TX0_N (out), PCIE1_TX0_P (out), PCIE1_RX0_N (in), PCIE1_RX0_P (in), PCIE1_CLK_N (out), PCIE1_CLK_P (out), 3V3_PCIE1_CLKREQ (in), 3V3_PCIE1_nRST (out), 1V8_UART0_TXD (out), 1V8_UART0_RXD (in), 1V8_UART0_RTS (in), 1V8_UART0_CTS (out), 1V8_BT_M2_WAKE_AP (GPIO02) (in), 1V8_W_DISABLE1_CTRL (GPIO05) (out), 1V8_BT_M2_EN (GPIO03) (out), 3V3_SUS_CLK_OUT (out), USB2_2_N (bidir), USB2_2_P (bidir), 1V8_I2S1_DOUT (out), 1V8_I2S1_DIN (in), 1V8_I2S1_FS (bidir), 1V8_I2S1_SCLK (bidir), 1V8_I2C2_SCL (out), 1V8_I2C2_SDA (bidir), 1V8_CAM0_PWDN (out), 1V8_CAM0_MCLK (out), 3V3_CAMI2C_SCL (out), 3V3_CAMI2C_SDA (bidir), ETH_MDI0_P (bidir), ETH_MDI0_N (bidir), ETH_MDI1_P (bidir), ETH_MDI1_N (bidir), ETH_MDI2_P (bidir), ETH_MDI2_N (bidir), ETH_MDI3_P (bidir), ETH_MDI3_N (bidir), USB2_1_N (bidir), USB2_1_P (bidir), OD_ETH_LED_LINK (out), OD_ETH_LED_ACT (out), DP1_TXD0_N (out), DP1_TXD0_P (out), DP1_TXD1_N (out), DP1_TXD1_P (out), DP1_TXD2_N (out), DP1_TXD2_P (out), DP1_TXD3_N (out), DP1_TXD3_P (out), 1V8_DP1_AUX_N (bidir), 1V8_DP1_AUX_P (bidir), 1V8_DP1_HPD (in), 3V3_DP1_CEC (bidir), 1V8_nMOD_SLEEP (out), 1V8_nM2_ALERT (in), 1V8_CPU_FAN_TACH (in), 1V8_CPU_FAN_PWM (out), 1V8_GPIO07_PWM (bidir), 1V8_GPIO13_PWM (bidir), USBSS1_RX_N (in), USBSS1_RX_P (in), USBSS1_TX_P (out), USBSS1_TX_N (out), USB2_0_N (bidir), USB2_0_P (bidir), 1V8_nUSB0_VBUS_DET (GPIO00) (in), 3V3_UART1_TXD (out), 3V3_UART1_RXD (in), 3V3_CAN_RX (in), 3V3_CAN_TX (out), 3V3_UART2_TXD (out), 3V3_UART2_RXD (in), HV_MODULE_ID (out), 5V0_nSHDN_REQ (out), 5V0_POWER_EN (in), 1V8_nSYS_RESET (out), 5V0_SLEEP/nWAKE (in), 1V8_nFRC_RECOVERY (out), CSI2_D0_N (bidir), CSI2_D0_P (bidir), CSI2_D1_N (bidir), CSI2_D1_P (bidir), CSI3_D0_N (bidir), CSI3_D0_P (bidir), CSI3_D1_N (bidir), CSI3_D1_P (bidir), CSI2_CLK_N (bidir), CSI2_CLK_P (bidir), 1V8_CAM1_PWDN (out), 1V8_CAM1_MCLK (out), 1V8_I2S0_DOUT (out), 1V8_I2S0_DIN (in), 1V8_I2S0_FS (bidir), 1V8_I2S0_SCLK (bidir), 1V8_nPWDN (out), 3V3_I2C0_SCL (out), 3V3_I2C0_SDA (bidir), 3V3_I2C1_SCL (out), 3V3_I2C1_SDA (bidir), 1V8_GPIO01 (bidir), 1V8_GPIO04 (bidir), 1V8_GPIO06 (bidir), 1V8_GPIO09 (bidir), 1V8_GPIO11 (bidir), 1V8_GPIO12 (bidir), PCIE0_RX3_N (in), PCIE0_RX3_P (in), PCIE0_RX2_N (in), PCIE0_RX2_P (in), PCIE0_RX1_N (in), PCIE0_RX1_P (in), PCIE0_RX0_N (in), PCIE0_RX0_P (in)
MCU_0 = STM32G473RET6_PINOUT: no entries
NVME_0 = M2_NVME: SMB_DATA (bidir), SMB_CLK (in), SMB_nALERT (out), PCIE_TX3_N (in), PCIE_TX3_P (in), PCIE_TX2_N (in), PCIE_TX2_P (in), PCIE_TX1_N (in), PCIE_TX1_P (in), PCIE_TX0_N (in), PCIE_TX0_P (in), PCIE_RX3_N (out), PCIE_RX3_P (out), PCIE_RX2_N (out), PCIE_RX2_P (out), PCIE_RX1_N (out), PCIE_RX1_P (out), PCIE_RX0_N (out), PCIE_RX0_P (out), PCIE_CLK_N (in), PCIE_CLK_P (in), 3V3_PCIE_nRST (in), 3V3_PCIE_nCLKREQ (out), 3V3_PCIE_nWAKE (out)
NVME_1 = M2_WIFI: WIFI_PCIE_TX0_P (in), WIFI_PCIE_TX0_N (in), WIFI_PCIE_RX0_P (out), WIFI_PCIE_RX0_N (out), WIFI_PCIE_CLK_P (in), WIFI_PCIE_CLK_N (in), USB2_P (bidir), USB2_N (bidir), 1V8_I2S_SCLK (in), 1V8_I2S_LRCK (in), 1V8_I2S_SDIN (out), 1V8_I2S_DOUT (in), 1V8_UART_RXD (out), 1V8_UART_TXD (in), 1V8_UART_RTS (in), 1V8_UART_CTS (out), 3V3_nUART_WAKE (out), 3V3_WIFI_PCIE_CLKREQ (out), 3V3_WIFI_PCIE_WAKE (out), 3V3_nWIFI_PCIE_RST (in), 1V8_I2C_SCK (in), 1V8_I2C_SDA (bidir), HV_W_DISABLE1 (in), HV_BT_M2_EN (in), 1V8_nALERT (out), 3V3_SUSCLK_IN (in), 1V8_AP_WAKE_BT (in)
OR_0 = LM74910H_PINOUT: PWR_IN (in), PWR_OUT (out), 3V3_nFLT (out), HV_nSLEEP (in), 3V3_IMON (out), 3V3_V_SENSE (out)
OR_1 = LM74910H_PINOUT: PWR_IN (in), PWR_OUT (out), 3V3_nFLT (out), HV_nSLEEP (in), 3V3_IMON (out), 3V3_V_SENSE (out)
PWR_MUX_0 = JETSON_PWR_MUX: 12V0_IN (in), 5V0_IN (in), 3V3_MODULE_ID (in), PWR_OUT (out), 3V3_V_SENSE (out)
PWR_PROT_0 = FUSE_AND_I_SENSE: PWR_IN (in), PWR_OUT (out), 3V3_I_SENSE (out), n3V3_I_FLT (out)
PWR_PROT_1 = FUSE_AND_I_SENSE: PWR_IN (in), PWR_OUT (out), 3V3_I_SENSE (out), n3V3_I_FLT (out)
PWR_PROT_2 = FUSE_AND_I_SENSE: PWR_IN (in), PWR_OUT (out), 3V3_I_SENSE (out), n3V3_I_FLT (out)
PWR_SW_AND_PROT_0 = FUSE_AND_VI_SENSE: PWR_IN (in), PWR_OUT (out), 3V3_I_SENSE (out), n3V3_I_FLT (out), HV_PWR_EN (in), 3V3_V_SENSE (out)
RAIL_DISCH_0 = RAIL_DISCHARGE: HV_RAIL (in), HV_RAIL_ENABLE (in)
RAIL_DISCH_1 = RAIL_DISCHARGE: HV_RAIL_ENABLE (in), HV_RAIL (in)
RAIL_DISCH_2 = RAIL_DISCHARGE: HV_RAIL_ENABLE (in), HV_RAIL (in)
REG_0 = INT_REG: PWR_IN (in), 5V0_OUT (out), 3V3_OUT (out), 5V0_V_SENSE (out), 3V3_V_SENSE (out)
REG_1 = LM5177_PINOUT: PWR_IN (in), PWR_OUT (out), HV_ENABLE (in), 3V3_nFLT (out), 3V3_V_SENSE (out), 3V3_TEMP_SENSE (out)
REG_2 = LM704A0_5V0_PINOUT: PWR_IN (in), PWR_OUT (out), HV_ENABLE (in), 3V3_nFLT (out), 3V3_V_SENSE (out), 3V3_TEMP_SENSE (out)
REG_3 = LM704A0_3V3_PINOUT: PWR_IN (in), PWR_OUT (out), HV_ENABLE (in), 3V3_nFLT (out), 3V3_V_SENSE (out), 3V3_TEMP_SENSE (out)
TCAN1146_0 = TCAN1146_PINOUT: CAN_P (bidir), CAN_N (bidir), HV_CAN_INH (out), TCAN_VCC (in), 3V3_CAN_TX (in), 3V3_CAN_RX (out), 3V3_CAN_MOSI (in), 3V3_CAN_MISO (out), 3V3_CAN_SCLK (in), 3V3_CAN_nCS (in)

## Nets
3V3_DES_0: F16.2 ; sheet DES_0/3V3_IN
3V3_DES_1: F17.2 ; sheet DES_1/3V3_IN
3V3_HDMI: F19.2
3V3_INT: R142.2 R145.2 R147.2 U17.5(VIN) U18.5(VCC) ; sheet REG_0/3V3_OUT
3V3_M2_NVME: F14.2
3V3_M2_WIFI: F15.2
3V3_MAIN: F14.1 F15.1 F16.1 F17.1 F18.1 F19.1 R164.1 R174.2 R177.2 ; sheet RAIL_DISCH_2/HV_RAIL, sheet REG_3/PWR_OUT
3V3_SER_0: F18.2
5V0_HDMI: F11.2
5V0_INT: sheet REG_0/5V0_OUT
5V0_JETSON: F10.2 U15.5(VIN) U16.5(VIN) ; sheet PWR_MUX_0/5V0_IN
5V0_MAIN: F10.1 F11.1 F12.1 F21.1 F22.1 R168.2 R169.2 R175.2 R176.2 ; sheet RAIL_DISCH_1/HV_RAIL, sheet REG_2/PWR_OUT
5V0_USB: F12.2 U19.5(VIN)
12V0_JETSON: F9.2 ; sheet PWR_MUX_0/12V0_IN
12V0_MAIN: F6.1 F7.1 F8.1 F9.1 ; sheet RAIL_DISCH_0/HV_RAIL, sheet REG_1/PWR_OUT
12V0_PoC_0: F6.2 ; sheet DES_0/PoC_PWR
12V0_PoC_1: F7.2 ; sheet DES_1/PoC_PWR
12V0_PoC_2: F8.2 J8.12
APM_VCC: J3.4 J3.5 J3.12 J3.13 J3.19 J3.20 ; sheet OR_1/PWR_IN
CAR_VCC: J3.1 J3.2 J3.9 J3.10 J3.16 J3.17 ; sheet OR_0/PWR_IN
ETH_GND: C5.2 C158.2 C159.2 C160.2 C161.2 C162.2 C163.2 C165.2 C166.2 J10.1(MNT_1) J10.2(MNT_2)
GND: C156.2 C158.1 C159.1 C160.1 C161.1 C162.1 C163.1 C164.2 C165.1 C166.1 D15.3(GND) D15.8(GND) D16.3(GND) D16.8(GND) D17.3(GND) D17.8(GND) D18.3(GND) D18.8(GND) D19.3(GND) D19.8(GND) D20.3(GND) D20.8(GND) D21.3(GND) D21.8(GND) D23.3(GND) D23.8(GND) D24.3(GND) D24.8(GND) D25.3(GND) D25.8(GND) D26.3(GND) D26.8(GND) D27.3(GND) D27.8(GND) D28.3(GND) D28.8(GND) D29.3(GND) D29.8(GND) J1.MH1 J1.MH2 J1.MH3 J1.MH4 J1.MH5 J3.3 J3.6 J3.7 J3.8 J3.11 J3.14 J3.15 J3.18 J3.21 J4.MH1 J4.MH2 J4.MH3 J4.MH4 J4.MH5 J5.2(GND) J5.5(GND) J5.8(GND) J5.11(GND) J5.17(GND) J5.20(MNT_1) J5.21(MNT_2) J5.22(MNT_3) J6.5(GND) J6.6(SHLD1) J6.7(SHLD2) J6.8(SHLD3) J6.9(SHLD4) J6.10(SHLD5) J6.11(SHLD6) J7.2 J8.5(MNT_1) J8.6(MNT_2) J8.7(MNT_3) J8.8(MNT_4) J8.9(MNT_5) J8.10(MNT_6) J8.11(MNT_7) J8.13 J9.1 J11.1 MH1.1(MH) MH1.2(V1) MH1.3(V2) MH1.4(V3) MH1.5(V4) MH1.6(V5) MH1.7(V6) MH2.1(MH) MH2.2(V1) MH2.3(V2) MH2.4(V3) MH2.5(V4) MH2.6(V5) MH2.7(V6) MH3.1(MH) MH3.2(V1) MH3.3(V2) MH3.4(V3) MH3.5(V4) MH3.6(V5) MH3.7(V6) MH4.1(MH) MH4.2(V1) MH4.3(V2) MH4.4(V3) MH4.5(V4) MH4.6(V5) MH4.7(V6) MH5.1(MH) MH5.2(V1) MH5.3(V2) MH5.4(V3) MH5.5(V4) MH5.6(V5) MH5.7(V6) MH6.1(MH) MH6.2(V1) MH6.3(V2) MH6.4(V3) MH6.5(V4) MH6.6(V5) MH6.7(V6) MH7.1(MH) MH7.2(V1) MH7.3(V2) MH7.4(V3) MH7.5(V4) MH7.6(V5) MH7.7(V6) MH8.1(MH) MH8.2(V1) MH8.3(V2) MH8.4(V3) MH8.5(V4) MH8.6(V5) MH8.7(V6) MH9.1(MH) MH9.2(V1) MH9.3(V2) MH9.4(V3) MH9.5(V4) MH9.6(V5) MH9.7(V6) MH10.1(MH) MH10.2(V1) MH10.3(V2) MH10.4(V3) MH10.5(V4) MH10.6(V5) MH10.7(V6) MH11.1(MH) MH11.2(V1) MH11.3(V2) MH11.4(V3) MH11.5(V4) MH11.6(V5) MH11.7(V6) MH12.1(MH) MH12.2(V1) MH12.3(V2) MH12.4(V3) MH12.5(V4) MH12.6(V5) MH12.7(V6) Q24.1(Source1) Q24.4(Source2) Q25.1(Source1) Q25.4(Source2) Q26.2(S) Q27.4(Source2) Q28.4(Source2) R138.1 R139.1 R140.1 R141.1 R144.1 R146.1 R150.1 R167.1 R180.1 R181.1 U15.2(GND) U16.2(GND) U17.2(GND) U18.1(~{OE}) U18.3(GND) U19.2(GND) U20.1(~{OE}) U20.3(GND)
INT_VCC: sheet PWR_PROT_0/PWR_IN, sheet REG_0/PWR_IN, sheet PWR_PROT_1/PWR_IN, sheet PWR_PROT_2/PWR_IN, sheet PWR_SW_AND_PROT_0/PWR_OUT
JETSON_VCC: sheet PWR_MUX_0/PWR_OUT
JSN_1V8_REF: C164.1 Q27.2(Gate1) Q28.2(Gate1) R143.2 R165.2 R170.2 R171.2 R182.1 U20.5(VCC)
PRE_VCC: R148.2 ; sheet TCAN1146_0/TCAN_VCC, sheet OR_0/PWR_OUT, sheet OR_1/PWR_OUT, sheet PWR_SW_AND_PROT_0/PWR_IN
1V8_CPU_FAN_PWM: R178.2 ; sheet JETSON/1V8_CPU_FAN_PWM
1V8_CPU_FAN_TACH: R172.2 ; sheet JETSON/1V8_CPU_FAN_TACH
1V8_GPIO07_PWM: R173.2 ; sheet JETSON/1V8_GPIO07_PWM
1V8_GPIO13_PWM: R179.2 ; sheet JETSON/1V8_GPIO13_PWM
1V8_I2C2_SCL: sheet JETSON/1V8_I2C2_SCL, sheet NVME_0/SMB_CLK, sheet NVME_1/1V8_I2C_SCK
1V8_I2C2_SDA: sheet JETSON/1V8_I2C2_SDA, sheet NVME_0/SMB_DATA, sheet NVME_1/1V8_I2C_SDA
1V8_nFRC_RECOVERY: sheet JETSON/1V8_nFRC_RECOVERY
1V8_nM2_ALERT: U20.4(Y) ; sheet JETSON/1V8_nM2_ALERT
1V8_nSYS_RESET: R143.1 R144.2 U17.4(EN) ; sheet JETSON/1V8_nSYS_RESET
1V8_nUSB0_VBUS_DET: R166.2
1V8_nUSB0_VBUS_DET (GPIO00): sheet JETSON/1V8_nUSB0_VBUS_DET (GPIO00)
3V3_3V3_INT_V_SENSE: sheet REG_0/3V3_V_SENSE, sheet ADC_0/3V3_IN7
3V3_3V3_MAIN_ENABLE: sheet RAIL_DISCH_2/HV_RAIL_ENABLE, sheet REG_3/HV_ENABLE
3V3_3V3_MAIN_nFLT: sheet REG_3/3V3_nFLT
3V3_3V3_MAIN_T_SENSE: sheet REG_3/3V3_TEMP_SENSE, sheet ADC_2/3V3_IN1
3V3_3V3_MAIN_V_SENSE: sheet ADC_1/3V3_IN7, sheet REG_3/3V3_V_SENSE
3V3_3V3_VCC_I_nFLT: sheet PWR_PROT_2/n3V3_I_FLT
3V3_3V3_VCC_I_SENSE: sheet PWR_PROT_2/3V3_I_SENSE, sheet ADC_2/3V3_IN0
3V3_5V0_INT_V_SENSE: sheet REG_0/5V0_V_SENSE, sheet ADC_0/3V3_IN6
3V3_5V0_MAIN_ENABLE: sheet RAIL_DISCH_1/HV_RAIL_ENABLE, sheet REG_2/HV_ENABLE
3V3_5V0_MAIN_nFLT: sheet REG_2/3V3_nFLT
3V3_5V0_MAIN_T_SENSE: sheet REG_2/3V3_TEMP_SENSE, sheet ADC_1/3V3_IN6
3V3_5V0_MAIN_V_SENSE: sheet REG_2/3V3_V_SENSE, sheet ADC_1/3V3_IN4
3V3_5V0_VCC_I_nFLT: sheet PWR_PROT_1/n3V3_I_FLT
3V3_5V0_VCC_I_SENSE: sheet PWR_PROT_1/3V3_I_SENSE, sheet ADC_1/3V3_IN5
3V3_12V0_MAIN_ENABLE: sheet RAIL_DISCH_0/HV_RAIL_ENABLE, sheet REG_1/HV_ENABLE
3V3_12V0_VCC_I_nFLT: sheet PWR_PROT_0/n3V3_I_FLT
3V3_12V_MAIN_nFLT: sheet REG_1/3V3_nFLT
3V3_12V_MAIN_T_SENSE: sheet ADC_1/3V3_IN3, sheet REG_1/3V3_TEMP_SENSE
3V3_12V_MAIN_V_SENSE: sheet ADC_1/3V3_IN1, sheet REG_1/3V3_V_SENSE
3V3_12V_VCC_I_SENSE: sheet PWR_PROT_0/3V3_I_SENSE, sheet ADC_1/3V3_IN2
3V3_APM_OR_nFLT: sheet OR_1/3V3_nFLT
3V3_CAMI2C_SCL: sheet JETSON/3V3_CAMI2C_SCL, sheet DES_0/3V3_SCL, sheet DES_1/3V3_SCL
3V3_CAMI2C_SDA: sheet JETSON/3V3_CAMI2C_SDA, sheet DES_0/3V3_SDA, sheet DES_1/3V3_SDA
3V3_CAN_RX: sheet JETSON/3V3_CAN_RX, sheet TCAN1146_0/3V3_CAN_RX
3V3_CAN_TX: sheet JETSON/3V3_CAN_TX, sheet TCAN1146_0/3V3_CAN_TX
3V3_CAR_APM_I_SENSE: sheet OR_1/3V3_IMON, sheet ADC_0/3V3_IN3
3V3_CAR_APM_V_SENSE: sheet OR_1/3V3_V_SENSE, sheet ADC_0/3V3_IN2
3V3_CAR_OR_nFLT: sheet OR_0/3V3_nFLT
3V3_CAR_VCC_I_SENSE: sheet OR_0/3V3_IMON, sheet ADC_0/3V3_IN1
3V3_CAR_VCC_V_SENSE: sheet OR_0/3V3_V_SENSE, sheet ADC_0/3V3_IN0
3V3_INPUT_I_SENSE: sheet ADC_0/3V3_IN5, sheet PWR_SW_AND_PROT_0/3V3_I_SENSE
3V3_INPUT_nI_FLT: sheet PWR_SW_AND_PROT_0/n3V3_I_FLT
3V3_INPUT_V_SENSE: sheet ADC_0/3V3_IN4, sheet PWR_SW_AND_PROT_0/3V3_V_SENSE
3V3_JETSON_VCC_V_SENSE: sheet ADC_1/3V3_IN0, sheet PWR_MUX_0/3V3_V_SENSE
3V3_MAIN_PWR_IN: sheet PWR_PROT_2/PWR_OUT, sheet REG_3/PWR_IN
3V3_MAX96724_0_EN_RF_A: sheet DES_0/HV_EN_RF_A
3V3_MAX96724_0_EN_RF_B: sheet DES_0/HV_EN_RF_B
3V3_MAX96724_0_EN_RF_C: sheet DES_0/HV_EN_RF_C
3V3_MAX96724_0_EN_RF_D: sheet DES_0/HV_EN_RF_D
3V3_MAX96724_0_nERRB: sheet DES_0/3V3_nERRB
3V3_MAX96724_0_nLOCK: sheet DES_0/3V3_nLOCK
3V3_MAX96724_1_EN_RF_A: sheet DES_1/HV_EN_RF_A
3V3_MAX96724_1_EN_RF_B: sheet DES_1/HV_EN_RF_B
3V3_MAX96724_1_EN_RF_C: sheet DES_1/HV_EN_RF_C
3V3_MAX96724_1_EN_RF_D: sheet DES_1/HV_EN_RF_D
3V3_MAX96724_1_nERRB: sheet DES_1/3V3_nERRB
3V3_MAX96724_1_nLOCK: sheet DES_1/3V3_nLOCK
3V3_MAX96724_I_SNS_nALERT_0: sheet DES_0/3V3_SNS_nALERT
3V3_MAX96724_I_SNS_nALERT_1: sheet DES_1/3V3_SNS_nALERT
3V3_MAX96724_I_SNS_SCL: sheet DES_0/3V3_SNS_SCL, sheet DES_1/3V3_SNS_SCL
3V3_MAX96724_I_SNS_SDA: sheet DES_0/3V3_SNS_SDA, sheet DES_1/3V3_SNS_SDA
3V3_MAX96751_nERRB: sheet HDMI_1/3V3_nERRB
3V3_MAX96751_nLOCK: sheet HDMI_1/3V3_nLOCK
3V3_MODULE_ID: U18.2(A) ; sheet JETSON/HV_MODULE_ID, sheet PWR_MUX_0/3V3_MODULE_ID
3V3_nSYS_RESET: R149.2 U17.1(VOUT)
3V3_PCIE_nWAKE: sheet JETSON/3V3_PCIE0_nWAKE, sheet NVME_0/3V3_PCIE_nWAKE, sheet NVME_1/3V3_WIFI_PCIE_WAKE
3V3_TCAN1146_MISO: sheet TCAN1146_0/3V3_CAN_MISO
3V3_TCAN1146_MOSI: sheet TCAN1146_0/3V3_CAN_MOSI
3V3_TCAN1146_nCS: sheet TCAN1146_0/3V3_CAN_nCS
3V3_TCAN1146_SCLK: sheet TCAN1146_0/3V3_CAN_SCLK
3V3_UART1_RXD: sheet JETSON/3V3_UART1_RXD
3V3_UART1_TXD: sheet JETSON/3V3_UART1_TXD
3V3_UART2_RXD: J7.4 ; sheet JETSON/3V3_UART2_RXD
3V3_UART2_TXD: J7.3 ; sheet JETSON/3V3_UART2_TXD
3V3_USB_PWR_EN: U19.4(EN)
5V0_DBG_USB_VBUS: C156.1 D23.4(IO3) J6.1(VBUS) Q26.1(G) R167.2
5V0_MAIN_PWR_IN: sheet REG_2/PWR_IN, sheet PWR_PROT_1/PWR_OUT
5V0_nSHDN_REQ: D14.1(C) ; sheet JETSON/5V0_nSHDN_REQ
5V0_POWER_EN: R138.2 U15.1(VOUT) ; sheet JETSON/5V0_POWER_EN
5V0_SLEEP/nWAKE: R140.2 U16.1(VOUT) ; sheet JETSON/5V0_SLEEP/nWAKE
12V0_MAIN_PWR_IN: sheet PWR_PROT_0/PWR_OUT, sheet REG_1/PWR_IN
ADC_MISO: sheet ADC_1/3V3_MISO, sheet ADC_0/3V3_MISO, sheet ADC_2/3V3_MISO
ADC_MOSI: sheet ADC_1/3V3_MOSI, sheet ADC_0/3V3_MOSI, sheet ADC_2/3V3_MOSI
ADC_SCLK: sheet ADC_1/3V3_SCLK, sheet ADC_0/3V3_SCLK, sheet ADC_2/3V3_SCLK
AMBIENT_TEMP: R145.1 R146.2 ; sheet ADC_2/3V3_IN7
CAN_N: J3.23 ; sheet TCAN1146_0/CAN_N
CAN_P: J3.22 ; sheet TCAN1146_0/CAN_P
ETH_MDI0_N: D27.2(IO2) J10.P2 ; sheet JETSON/ETH_MDI0_N
ETH_MDI0_P: D27.1(IO1) J10.P1 ; sheet JETSON/ETH_MDI0_P
ETH_MDI1_N: D27.5(IO4) J10.P4 ; sheet JETSON/ETH_MDI1_N
ETH_MDI1_P: D27.4(IO3) J10.P3 ; sheet JETSON/ETH_MDI1_P
ETH_MDI2_N: D28.2(IO2) J10.P8 ; sheet JETSON/ETH_MDI2_N
ETH_MDI2_P: D28.1(IO1) J10.P7 ; sheet JETSON/ETH_MDI2_P
ETH_MDI3_N: D28.5(IO4) J10.P10 ; sheet JETSON/ETH_MDI3_N
ETH_MDI3_P: D28.4(IO3) J10.P9 ; sheet JETSON/ETH_MDI3_P
ETH_USB_5V: D29.1(IO1) U19.1(VOUT)
FAN_0_PWM: J9.4 Q27.3(Drain2) R175.1
FAN_0_TACH: J9.3 Q27.6(Drain1) R168.1
FAN_1_PWM: J11.4 Q28.3(Drain2) R176.1
FAN_1_TACH: J11.3 Q28.6(Drain1) R169.1
HDMI_5V: D21.2(IO2) D21.9(NC) J5.18(5V) R279.1 ; sheet DP_TO_HDMI_0/HDMI_5V0
HDMI_CEC: J5.13(CEC) ; sheet DP_TO_HDMI_0/3V3_HDMI_CEC
HDMI_CLK_N: R158.1 R276.1 ; sheet DP_TO_HDMI_0/HDMI_CLK_N
HDMI_CLK_P: R157.1 R275.1 ; sheet DP_TO_HDMI_0/HDMI_CLK_P
HDMI_D0_N: R156.1 R270.1 ; sheet DP_TO_HDMI_0/HDMI_D0_N
HDMI_D0_P: R155.1 R269.1 ; sheet DP_TO_HDMI_0/HDMI_D0_P
HDMI_D1_N: R154.1 R272.1 ; sheet DP_TO_HDMI_0/HDMI_D1_N
HDMI_D1_P: R153.1 R271.1 ; sheet DP_TO_HDMI_0/HDMI_D1_P
HDMI_D2_N: R152.1 R274.1 ; sheet DP_TO_HDMI_0/HDMI_D2_N
HDMI_D2_P: R151.1 R273.1 ; sheet DP_TO_HDMI_0/HDMI_D2_P
HDMI_HP_DET: D21.1(IO1) D21.10(NC) J5.19(HOTPLUG) R280.1 ; sheet DP_TO_HDMI_0/HDMI_HP_DET
HDMI_SCL: D21.5(IO4) D21.6(NC) J5.15(SCL) R278.1 ; sheet DP_TO_HDMI_0/5V0_HDMI_SCL
HDMI_SDA: D21.4(IO3) D21.7(NC) J5.16(SDA) R277.1 ; sheet DP_TO_HDMI_0/5V0_HDMI_SDA
HV_PWR_EN: sheet TCAN1146_0/HV_CAN_INH, sheet OR_0/HV_nSLEEP, sheet OR_1/HV_nSLEEP, sheet PWR_SW_AND_PROT_0/HV_PWR_EN
HV_SYS_RESET: Q24.2(Gate1) Q24.5(Gate2) Q25.5(Gate2) Q25.6(Drain1) R148.1
nNVME_M2_ALERT: R184.2 ; sheet NVME_0/SMB_nALERT
nWIFI_M2_ALERT: R183.2 ; sheet NVME_1/1V8_nALERT
OD_ETH_LED_ACT: J10.P13(2_ANODE_GREEN/2_CATHODE_YELLOW) ; sheet JETSON/OD_ETH_LED_ACT
OD_ETH_LED_LINK: J10.P12(1_CATHODE_GREEN/1_ANODE_YELLOW) ; sheet JETSON/OD_ETH_LED_LINK
P1_5V: D29.5(IO4)
P1_CK_N: D20.1(IO1) D20.10(NC) J5.12(CK_N) R158.2
P1_CK_P: D20.2(IO2) D20.9(NC) J5.10(CK_P) R157.2
P1_D0_N: D20.4(IO3) D20.7(NC) J5.9(D0_N) R156.2
P1_D0_P: D20.5(IO4) D20.6(NC) J5.7(D0_P) R155.2
P1_D1_N: D19.1(IO1) D19.10(NC) J5.6(D1_N) R154.2
P1_D1_P: D19.2(IO2) D19.9(NC) J5.4(D1_P) R153.2
P1_D2_N: D19.4(IO3) D19.7(NC) J5.3(D2_N) R152.2
P1_D2_P: D19.5(IO4) D19.6(NC) J5.1(D2_P) R151.2
RF_MAX96724_0_SIO_A: J1.2 ; sheet DES_0/RF_A
RF_MAX96724_0_SIO_B: J1.1 ; sheet DES_0/RF_B
RF_MAX96724_0_SIO_C: J1.4 ; sheet DES_0/RF_C
RF_MAX96724_0_SIO_D: J1.3 ; sheet DES_0/RF_D
RF_MAX96724_1_SIO_A: J4.2 ; sheet DES_1/RF_A
RF_MAX96724_1_SIO_B: J4.1 ; sheet DES_1/RF_B
RF_MAX96724_1_SIO_C: J4.4 ; sheet DES_1/RF_C
RF_MAX96724_1_SIO_D: J4.3 ; sheet DES_1/RF_D
RF_MAX96751_0_A_N: J8.3 ; sheet HDMI_1/RF_A_N
RF_MAX96751_0_A_P: J8.1 ; sheet HDMI_1/RF_A_P
RF_MAX96751_0_B_N: J8.2 ; sheet HDMI_1/RF_B_N
RF_MAX96751_0_B_P: J8.4 ; sheet HDMI_1/RF_B_P
RJ45_CT_CAP: C5.1 J10.P5 J10.P6
USB2_0_N: D23.2(IO2) J6.2(D-) ; sheet JETSON/USB2_0_N
USB2_0_P: D23.1(IO1) J6.3(D+) ; sheet JETSON/USB2_0_P
USB2_1_N: D29.2(IO2) ; sheet JETSON/USB2_1_N
USB2_1_P: D29.4(IO3) ; sheet JETSON/USB2_1_P
USBSS1_RX_N: sheet JETSON/USBSS1_RX_N
USBSS1_RX_P: sheet JETSON/USBSS1_RX_P
USBSS1_TX_N: sheet JETSON/USBSS1_TX_N
USBSS1_TX_P: sheet JETSON/USBSS1_TX_P
NetD14_2: D14.2(A) R142.1
NetF21_2: F21.2 J9.2
NetF22_2: F22.2 J11.2
NetJ7_1: J7.1 R164.2
NetJ10_P11: J10.P11(1_ANODE_GREEN/1_CATHODE_YELLOW) R174.1
NetJ10_P14: J10.P14(2_CATHODE_GREEN/2_ANODE_YELLOW) R177.1
NetQ25_2: Q25.2(Gate1) R149.1 R150.2
NetQ26_3: Q26.3(D) R165.1 R166.1
NetQ27_1: Q27.1(Source1) R170.1 R172.1
NetQ27_5: Q27.5(Gate2) R178.1 R180.2
NetQ28_1: Q28.1(Source1) R171.1 R173.1
NetQ28_5: Q28.5(Gate2) R179.1 R181.2
NetR139_2: R139.2 U15.4(EN)
NetR141_2: R141.2 U16.4(EN)
NetR147_1: R147.1 U18.4(Y)
NetR182_2: R182.2 R183.1 R184.1 U20.2(A)
NetR269_2: R269.2 ; sheet HDMI_1/IN_D0_P
NetR270_2: R270.2 ; sheet HDMI_1/IN_D0_N
NetR271_2: R271.2 ; sheet HDMI_1/IN_D1_P
NetR272_2: R272.2 ; sheet HDMI_1/IN_D1_N
NetR273_2: R273.2 ; sheet HDMI_1/IN_D2_P
NetR274_2: R274.2 ; sheet HDMI_1/IN_D2_N
NetR275_2: R275.2 ; sheet HDMI_1/IN_CK_P
NetR276_2: R276.2 ; sheet HDMI_1/IN_CK_N
NetR277_2: R277.2 ; sheet HDMI_1/DDC_SDA
NetR278_2: R278.2 ; sheet HDMI_1/DDC_SCK
NetR279_2: R279.2 ; sheet HDMI_1/HDMI_5V
NetR280_2: R280.2 ; sheet HDMI_1/3V3_HPD
NetTP1_1: TP1.1(TP) ; sheet JETSON/3V3_I2C1_SDA
NetTP2_1: TP2.1(TP) ; sheet JETSON/3V3_I2C1_SCL
NetTP3_1: TP3.1(TP) ; sheet JETSON/1V8_GPIO01
NetTP4_1: TP4.1(TP) ; sheet JETSON/1V8_GPIO04
NetTP5_1: TP5.1(TP) ; sheet JETSON/1V8_GPIO06
NetTP6_1: TP6.1(TP) ; sheet JETSON/1V8_GPIO09
NetTP7_1: TP7.1(TP) ; sheet JETSON/1V8_GPIO11
NetTP8_1: TP8.1(TP) ; sheet JETSON/1V8_GPIO12
(unnamed): sheet JETSON/CSI0_D0_N, sheet DES_0/CSI0_D0_N
(unnamed): sheet JETSON/CSI0_D0_P, sheet DES_0/CSI0_D0_P
(unnamed): sheet JETSON/CSI0_D1_N, sheet DES_0/CSI0_D1_P
(unnamed): sheet JETSON/CSI0_D1_P, sheet DES_0/CSI0_D1_N
(unnamed): sheet JETSON/CSI1_D0_N, sheet DES_0/CSI0_D2_P
(unnamed): sheet JETSON/CSI1_D0_P, sheet DES_0/CSI0_D2_N
(unnamed): sheet JETSON/CSI1_D1_N, sheet DES_0/CSI0_D3_N
(unnamed): sheet JETSON/CSI1_D1_P, sheet DES_0/CSI0_D3_P
(unnamed): sheet JETSON/CSI0_CLK_N, sheet DES_0/CSI0_CK_N
(unnamed): sheet JETSON/CSI0_CLK_P, sheet DES_0/CSI0_CK_P
(unnamed): sheet JETSON/PCIE0_TX0_N, sheet NVME_0/PCIE_TX3_N
(unnamed): sheet JETSON/PCIE0_TX0_P, sheet NVME_0/PCIE_TX3_P
(unnamed): sheet JETSON/PCIE0_TX1_N, sheet NVME_0/PCIE_TX2_N
(unnamed): sheet JETSON/PCIE0_TX1_P, sheet NVME_0/PCIE_TX2_P
(unnamed): sheet JETSON/PCIE0_TX2_N, sheet NVME_0/PCIE_TX1_N
(unnamed): sheet JETSON/PCIE0_TX2_P, sheet NVME_0/PCIE_TX1_P
(unnamed): sheet JETSON/PCIE0_TX3_N, sheet NVME_0/PCIE_TX0_N
(unnamed): sheet JETSON/PCIE0_TX3_P, sheet NVME_0/PCIE_TX0_P
(unnamed): sheet JETSON/PCIE0_CLK_N, sheet NVME_0/PCIE_CLK_N
(unnamed): sheet JETSON/PCIE0_CLK_P, sheet NVME_0/PCIE_CLK_P
(unnamed): sheet JETSON/3V3_PCIE0_CLKREQ, sheet NVME_0/3V3_PCIE_nCLKREQ
(unnamed): sheet JETSON/3V3_PCIE0_nRST, sheet NVME_0/3V3_PCIE_nRST
(unnamed): sheet JETSON/PCIE1_TX0_N, sheet NVME_1/WIFI_PCIE_TX0_N
(unnamed): sheet JETSON/PCIE1_TX0_P, sheet NVME_1/WIFI_PCIE_TX0_P
(unnamed): sheet JETSON/PCIE1_RX0_N, sheet NVME_1/WIFI_PCIE_RX0_P
(unnamed): sheet JETSON/PCIE1_RX0_P, sheet NVME_1/WIFI_PCIE_RX0_N
(unnamed): sheet JETSON/PCIE1_CLK_N, sheet NVME_1/WIFI_PCIE_CLK_P
(unnamed): sheet JETSON/PCIE1_CLK_P, sheet NVME_1/WIFI_PCIE_CLK_N
(unnamed): sheet JETSON/3V3_PCIE1_CLKREQ, sheet NVME_1/3V3_WIFI_PCIE_CLKREQ
(unnamed): sheet JETSON/3V3_PCIE1_nRST, sheet NVME_1/3V3_nWIFI_PCIE_RST
(unnamed): sheet JETSON/1V8_UART0_TXD, sheet NVME_1/1V8_UART_TXD
(unnamed): sheet JETSON/1V8_UART0_RXD, sheet NVME_1/1V8_UART_RXD
(unnamed): sheet JETSON/1V8_UART0_RTS, sheet NVME_1/1V8_UART_RTS
(unnamed): sheet JETSON/1V8_UART0_CTS, sheet NVME_1/1V8_UART_CTS
(unnamed): sheet JETSON/1V8_BT_M2_WAKE_AP (GPIO02), sheet NVME_1/3V3_nUART_WAKE
(unnamed): sheet JETSON/1V8_W_DISABLE1_CTRL (GPIO05), sheet NVME_1/HV_W_DISABLE1
(unnamed): sheet JETSON/1V8_BT_M2_EN (GPIO03), sheet NVME_1/HV_BT_M2_EN
(unnamed): sheet JETSON/3V3_SUS_CLK_OUT, sheet NVME_1/3V3_SUSCLK_IN
(unnamed): sheet JETSON/USB2_2_N, sheet NVME_1/USB2_N
(unnamed): sheet JETSON/USB2_2_P, sheet NVME_1/USB2_P
(unnamed): sheet JETSON/1V8_I2S1_DOUT, sheet NVME_1/1V8_I2S_DOUT
(unnamed): sheet JETSON/1V8_I2S1_DIN, sheet NVME_1/1V8_I2S_SDIN
(unnamed): sheet JETSON/1V8_I2S1_FS, sheet NVME_1/1V8_I2S_LRCK
(unnamed): sheet JETSON/1V8_I2S1_SCLK, sheet NVME_1/1V8_I2S_SCLK
(unnamed): sheet JETSON/1V8_CAM0_PWDN, sheet DES_0/1V8_nPWDN
(unnamed): sheet JETSON/DP1_TXD0_N, sheet DP_TO_HDMI_0/DP_TXD0_N
(unnamed): sheet JETSON/DP1_TXD0_P, sheet DP_TO_HDMI_0/DP_TXD0_P
(unnamed): sheet JETSON/DP1_TXD1_N, sheet DP_TO_HDMI_0/DP_TXD1_N
(unnamed): sheet JETSON/DP1_TXD1_P, sheet DP_TO_HDMI_0/DP_TXD1_P
(unnamed): sheet JETSON/DP1_TXD2_N, sheet DP_TO_HDMI_0/DP_TXD2_N
(unnamed): sheet JETSON/DP1_TXD2_P, sheet DP_TO_HDMI_0/DP_TXD2_P
(unnamed): sheet JETSON/DP1_TXD3_N, sheet DP_TO_HDMI_0/DP_TXD3_N
(unnamed): sheet JETSON/DP1_TXD3_P, sheet DP_TO_HDMI_0/DP_TXD3_P
(unnamed): sheet JETSON/1V8_DP1_AUX_N, sheet DP_TO_HDMI_0/1V8_DP1_AUX_N
(unnamed): sheet JETSON/1V8_DP1_AUX_P, sheet DP_TO_HDMI_0/1V8_DP1_AUX_P
(unnamed): sheet JETSON/1V8_DP1_HPD, sheet DP_TO_HDMI_0/1V8_DP_HPD
(unnamed): sheet JETSON/3V3_DP1_CEC, sheet DP_TO_HDMI_0/3V3_DP_HDMI_CEC
(unnamed): sheet JETSON/1V8_nMOD_SLEEP, sheet DP_TO_HDMI_0/1V8_nMOD_SLEEP
(unnamed): sheet JETSON/CSI2_D0_N, sheet DES_1/CSI0_D0_N
(unnamed): sheet JETSON/CSI2_D0_P, sheet DES_1/CSI0_D0_P
(unnamed): sheet JETSON/CSI2_D1_N, sheet DES_1/CSI0_D1_N
(unnamed): sheet JETSON/CSI2_D1_P, sheet DES_1/CSI0_D1_P
(unnamed): sheet JETSON/CSI3_D0_N, sheet DES_1/CSI0_D2_N
(unnamed): sheet JETSON/CSI3_D0_P, sheet DES_1/CSI0_D2_P
(unnamed): sheet JETSON/CSI3_D1_N, sheet DES_1/CSI0_D3_N
(unnamed): sheet JETSON/CSI3_D1_P, sheet DES_1/CSI0_D3_P
(unnamed): sheet JETSON/CSI2_CLK_N, sheet DES_1/CSI0_CK_N
(unnamed): sheet JETSON/CSI2_CLK_P, sheet DES_1/CSI0_CK_P
(unnamed): sheet JETSON/1V8_CAM1_PWDN, sheet DES_1/1V8_nPWDN
(unnamed): sheet JETSON/1V8_I2S0_DOUT, sheet HDMI_1/I2S_DATA_IN
(unnamed): sheet JETSON/1V8_I2S0_FS, sheet HDMI_1/I2S_nWS
(unnamed): sheet JETSON/1V8_I2S0_SCLK, sheet HDMI_1/I2S_SCLK
(unnamed): sheet JETSON/1V8_nPWDN, sheet HDMI_1/1V8_nPWDN
(unnamed): sheet JETSON/3V3_I2C0_SCL, sheet HDMI_1/3V3_SCL
(unnamed): sheet JETSON/3V3_I2C0_SDA, sheet HDMI_1/3V3_SDA
(unnamed): sheet JETSON/PCIE0_RX3_N, sheet NVME_0/PCIE_RX0_N
(unnamed): sheet JETSON/PCIE0_RX3_P, sheet NVME_0/PCIE_RX0_P
(unnamed): sheet JETSON/PCIE0_RX2_N, sheet NVME_0/PCIE_RX1_N
(unnamed): sheet JETSON/PCIE0_RX2_P, sheet NVME_0/PCIE_RX1_P
(unnamed): sheet JETSON/PCIE0_RX1_N, sheet NVME_0/PCIE_RX2_N
(unnamed): sheet JETSON/PCIE0_RX1_P, sheet NVME_0/PCIE_RX2_P
(unnamed): sheet JETSON/PCIE0_RX0_N, sheet NVME_0/PCIE_RX3_N
(unnamed): sheet JETSON/PCIE0_RX0_P, sheet NVME_0/PCIE_RX3_P

Not connected (* = marked no-connect by the designer): D15 1(IO1) 2(IO2) 4(IO3) 5(IO4) 6(NC) 7(NC) 9(NC) 10(NC); D16 1(IO1) 2(IO2) 4(IO3) 5(IO4) 6(NC) 7(NC) 9(NC) 10(NC); D17 1(IO1) 2(IO2) 4(IO3) 5(IO4) 6(NC) 7(NC) 9(NC) 10(NC); D18 1(IO1) 2(IO2) 4(IO3) 5(IO4) 6(NC) 7(NC) 9(NC) 10(NC); D23 5(IO4) 6(NC) 7(NC) 9(NC) 10(NC); D24 1(IO1) 2(IO2) 4(IO3) 5(IO4) 6(NC) 7(NC) 9(NC) 10(NC); D25 1(IO1) 2(IO2) 4(IO3) 5(IO4) 6(NC) 7(NC) 9(NC) 10(NC); D26 1(IO1) 2(IO2) 4(IO3) 5(IO4) 6(NC) 7(NC) 9(NC) 10(NC); D27 6(NC) 7(NC) 9(NC) 10(NC); D28 6(NC) 7(NC) 9(NC) 10(NC); D29 6(NC) 7(NC) 9(NC) 10(NC); J5 14(RSVD)*; J6 4(ID)*; Q23 1(Source1) 2(Gate1) 3(Drain2) 4(Source2) 5(Gate2) 6(Drain1); Q24 3(Drain2) 6(Drain1); Q25 3(Drain2); U15 3(nFLG)*; U16 3(nFLG)*; U17 3(nFLG)*; U19 3(nFLG)*

## Layout directives
differential pair; differential pair class 90DIFF: USB2_0_N, USB2_0_P
net class PWR: 3V3_DES_0, 3V3_DES_1, 3V3_HDMI, 3V3_INT, 3V3_M2_NVME, 3V3_M2_WIFI, 3V3_MAIN, 3V3_SER_0, 5V0_HDMI, 5V0_INT, 5V0_JETSON, 5V0_MAIN, 5V0_USB, 12V0_JETSON, 12V0_MAIN, 12V0_PoC_0, 12V0_PoC_1, 12V0_PoC_2
differential pair; differential pair class 100DIFF: P1_CK_N, P1_CK_P, P1_D0_N, P1_D0_P, P1_D1_N, P1_D1_P, P1_D2_N, P1_D2_P

## Notes on the sheet
- 14P AMPSEAL
- CONFIRM RAIL DISCHARGE TIMES
- SUPPORT MCU
- PoC_0 --> DES 0 | 3A
  PoC_1 --> DES 1 | 3A
  PoC_2 --> SER 0 | 2A
- Above all else, this V_SENSE allows the MCU to confirm that MODULE_ID corresponds to the JETSON_VCC being provided
- ADCs go to support MCU to ensure power decisions can be made even if Jetson is off. Support MCU should be able to monitor for short conditions and react accordingly
- nFLT pins are equivalent to PG where PG is an active high signal
- POWER DISTRIBUTION
- INTERNAL
  INTERFACES
- EXTERNAL
  INTERFACES
- EXTERNAL CONNECTORS
- ESD
  PROTECTION
- TX and RX lane order flipped. Plarity maintained though
- CSI0_D1 and CSI1_D0 are swapped on Jetson module. Both Jetson and MAX96724 support polarity swap tho so leaving as is
- RAIL FORCE OFF SAFETY CIRCUIT (DNP?)
- 2x 4P INPUT
- FAKRA
- V_GS threshold is slightly higher than 2V for this NMOS but don't want to invest in another part so using 3V3 version of nSYS_RESET signal here
- ADD PUs FOR THIS I2C
- RX and CLK lane polarity flipped
- DBG CONNECTORS
- HDMI
- USB TYPE A
- Jumpers instead of HDMI mux here to reduce system complexity
- (near R164) 3V3 HERE FOR VREF ONLY
- (near TP1) Connections to Jetson schematic from WiFi M.2 seem completely fucked
- Surely nMOD_SLEEP connects to more things in ref design. Probably useless in this design tho
  It does not. nMOD_SLEEP used to turn off power/499 PDs on HDMI to conform to HDMI 2.0 spec
- UART
- No jumpers here since caps in MAX96751
- 1x 2P OUTPUT
- HSD
- HDMI I2C PUs in DP to HDMI schem
- All unused GPIOs/I2C interfaces exposed just in case. SPI not exposed since I don't intend to do anything with it, support MCU is the only one with SPI
- CEC unused by MAX96751
- FAN IFs
- https://www.te.com/commerce/DocumentDelivery/DDEController?Action=srchrtrv&DocNm=5-2301995-4&DocType=Customer%20Drawing&DocLang=English&DocFormat=pdf&PartCntxt=5-2301995-4
- RJ45
- CONFIRM I2S ROUTING HERE, PROB WON'T USE IT ANYWAYS BUT TRY TO GET IT RIGHT
- NOTES / BOARD REQUIREMENTS
- USBA
- MOUNTING HOLES
- External facing connectors:
  2x 4p fakra for cams
  1x 1p STP HSD for display
  1x RJ45 for eth
  1x 14p ampseal for pwr+can
- Internal facing connectors:
  ?x stacking connectors to child board
  2?x fan headers
- Corresponding Jetson I/O interfaces required:
  2x 4-lane CSI interfaces
  ETH
  2x M.2 (SSD+WiFi)
  HDMI (mux HDMI with SerDes to have HDMI for debug)
  2x fan headers
  DBG usb/UART
  2x USB (no hub onboard)
  2x SPI (one for ADCs, one for TCAN + maybe more ADCs)
  1x CAN
- Debug connectors:
  1x HDMI? maybe add mux
  2x USB
  1x dbg USB C
  1x 4p UART (inc 3v3/5v w/ jmp)
- M2 nALERT MUX
- ETH GND POUR CAPS/JUMPERS
- Board requirements:
  - handle car battery power
  - selective CAN wakeup
  - siren audio amplifier (I2S?)
  - 8 GMSL video inputs
  - 2 HDMI or GMSL out (GMSL ideal)
  - I2C channel for GMSL deserializers, use both CAM_I2C and I2C_0 in parallel with dummy resistors
  - M.2 slot (PCIe_0)
  - 3x USB 2
  - power protection (RP, OC, UV)
  - OV protection on Jetson VDD_IN
  - 5V (>5A), 3V3, and 1V8? regulators
  - USB C recovery port?
  - Softstart circuit
  - Fan header
  Datasheet knowledge:
  - CSI_0 and CSI_2 can support 4 cams, others may not
  - Add ESD diodes between all lines and GND
  - CAM I2C or regular I2C is ok
  - PCIe 0 is only 4x interface
  - I2C2 is 1V8, others are all 3V3
  - when SYS_RESET is low, max voltage to any I/O pin is 0.5V
  - when SHUTDOWN_REQ goes low, deassert POWER_EN as soon as possible (module will then assert nSYS_RESET to shut down baseboard)
  - section 3.6.2 for I/O shutdown timing IMPORTANT
  - Cut ground plane under all pads of high speed signals
- BE CAREFUL OF SERCOM I/O VOLTAGE FROM JETSON
- Labels drawn without touching a wire or pin: 1V8_nFRC_RECOVERY, 3V3_3V3_MAIN_ENABLE, 3V3_5V0_MAIN_ENABLE, 3V3_12V0_MAIN_ENABLE, 3V3_MAX96724_I_SNS_nALERT_0, 3V3_MAX96724_I_SNS_nALERT_1, 3V3_MAX96724_I_SNS_SCL, 3V3_MAX96724_I_SNS_SDA, RF_MAX96724_0_SIO_A, RF_MAX96724_0_SIO_B, RF_MAX96724_0_SIO_C, RF_MAX96724_0_SIO_D, RF_MAX96724_1_SIO_A, RF_MAX96724_1_SIO_B, RF_MAX96724_1_SIO_C, RF_MAX96724_1_SIO_D
- (in symbol CMP-002-00098-1) RF1; RF2; RF3; RF4; DC1; DC2